# Altium project B905AA.PrjPcb (part 1 of 2)
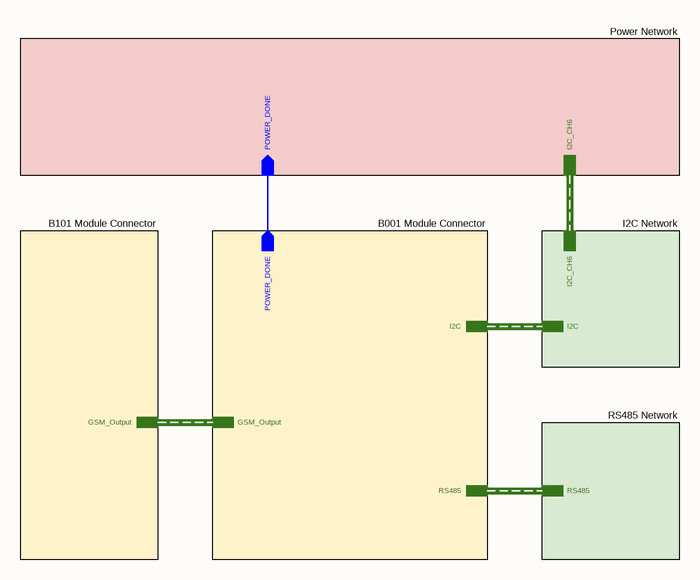
[diagram p0: Block Diagram.SchDoc]
Address1_: Buyuk Kayacik Mah. 4. OSB; Address2_: 103. Cad. No : 12; Address3_: Selcuklu / Konya; Address4_: Türkiye; Copyright_: Copyright 2022 STF Tarim (Commercial Secret); Customer_: STF Irrigation; Engineer_: Gunce Akkoyun; Git_Repo_Address_: www.github.com/akkoyun/B905AA; Module_ID_: B905AA; Organization_: STF Res-Dev; Product_Desc_: P101DA; Product_ID_: P101DA; Revision_: 00.00.01; Version_: R1
18 sheets, 99 parts. Net scope: hierarchical (ports join the sheet entries above them; power ports are global).
Board file: B905AA.PcbDoc
Sheets:
  Block Diagram.SchDoc
    B001 Module Connector = B001 PCIe Socket.SchDoc
    B101 Module Connector = B101 PCIe Socket.SchDoc
    I2C Network = I2C Network.SchDoc
      I2C Multiplexer = I2C Multiplexer.SchDoc
      I2C DP Sensor 1 = I2C DP Sensor 1.SchDoc
      I2C DP Sensor 2 = I2C DP Sensor 2.SchDoc
      I2C DP Sensor 3 = I2C DP Sensor 3.SchDoc
      TH Sensor Connector = I2C TH Sensor Socket.SchDoc
      UV Sensor Connector = I2C UV Sensor.SchDoc
      Pressure Sensor = I2C P Sensor.SchDoc
    RS485 Network = RS485 Network.SchDoc
      RS485 Multiplexer = RS485 Multiplexer.SchDoc
      RS485 Rain Sensor Socket = RS485 Rain Sensor Socket.SchDoc
      RS485 ST Sensor Socket = RS485 Soil Temperature Sensor Socket.SchDoc
      RS485 Under Leaf Sensor Socket = RS485 Under Leaf Sensor Socket.SchDoc
      RS485 Reserved Sensor Socket = RS485 Reserved Sensor Socket.SchDoc
    Power Network = B802 PCIe Socket.SchDoc

## Sheet Block Diagram.SchDoc: Block Diagram
size 292 x 193 mm; SheetNumber: 1; SheetTotal: 18

### Sub-sheets
B001 Module Connector = B001 PCIe Socket.SchDoc: I2C (harness I2C), GSM_Output (harness GSM_Output), RS485 (harness RS485), POWER_DONE (out)
B101 Module Connector = B101 PCIe Socket.SchDoc: GSM_Output (harness GSM_Output)
I2C Network = I2C Network.SchDoc: I2C (harness I2C), I2C_CH6 (harness I2C_CH6)
Power Network = B802 PCIe Socket.SchDoc: POWER_DONE (in), I2C_CH6 (harness I2C_CH6)
RS485 Network = RS485 Network.SchDoc: RS485 (harness RS485)

### Nets
POWER_DONE: sheet B001 Module Connector/POWER_DONE, sheet Power Network/POWER_DONE

### Buses and harness runs
harness sheet B001 Module Connector/GSM_Output = sheet B101 Module Connector/GSM_Output
harness sheet B001 Module Connector/I2C = sheet I2C Network/I2C
harness sheet B001 Module Connector/RS485 = sheet RS485 Network/RS485
harness sheet I2C Network/I2C_CH6 = sheet Power Network/I2C_CH6

### Notes on the sheet
- © 2021 All rights reserved.
  This document may not, in whole or in part, be copied, photocopied, reproduced, translated or converted to any electronic or machine readable from without prior written permission of Mehmet Günce Akkoyun.
  Engineer contact : akkoyun@me.com
- Property of
- Engineer :
- Date :
- Size :
- A4
- Time :
- Project :
- Page :
- /
- Customer :
- Product ID :
- Module ID :
- Version :
- File :
- Revision :

## Sheet B001 PCIe Socket.SchDoc: B001 PCIe Socket
size 292 x 193 mm; SheetNumber: 16; SheetTotal: 18
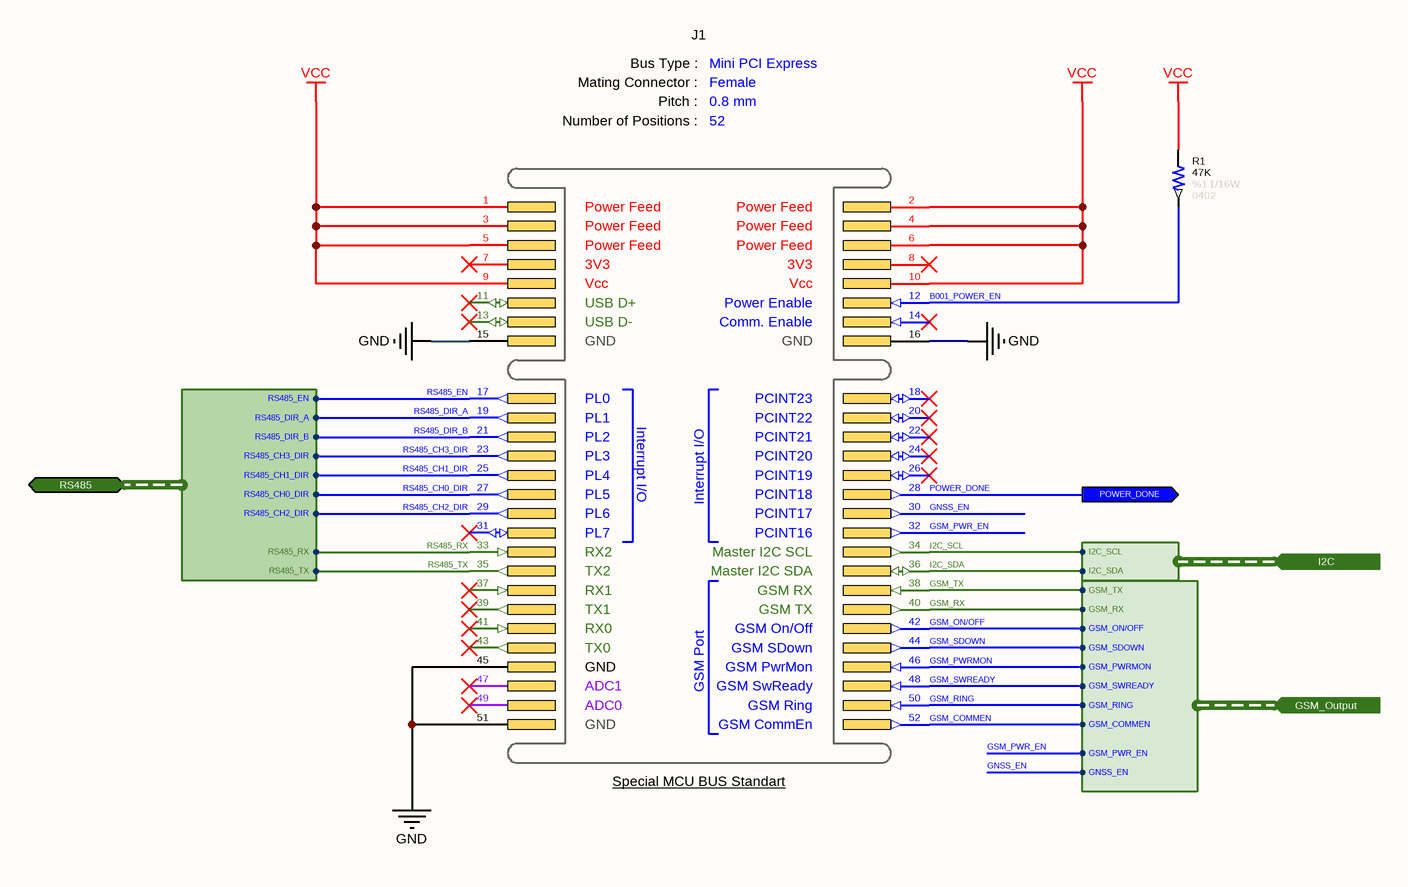
[diagram p1: B001 PCIe Socket.SchDoc]

### Parts
J1  BUS Type: Mini PCI Express  Connector Type: Female  Pitch: 0.8 mm  Number of Positions: 52  [CONNECTOR - Mini PCIe]  (hidden comment: TE-1775862-2)
R1  value 47K  Tolerance: %1  Case: 0402  Power: 1/16W  [RESISTOR_0402]  (hidden comment: 47K - 0402 - %1 - 1/16W)

### Ports
GSM_Output (in, harness GSM_Output), I2C (in, harness I2C), POWER_DONE (out), RS485 (bidir, harness RS485)

### Harnesses
I2C: I2C_SDA, I2C_SCL
RS485: RS485_RX, RS485_TX, RS485_EN, RS485_DIR_A, RS485_DIR_B, RS485_CH0_DIR, RS485_CH1_DIR, RS485_CH2_DIR, RS485_CH3_DIR
GSM_Output: GSM_SDOWN, GSM_ON/OFF, GSM_TX, GSM_RX, GSM_PWRMON, GSM_SWREADY, GSM_RING, GSM_COMMEN, GSM_PWR_EN, GNSS_EN

### Nets
GND: J1.15(Pin-15) J1.16(Pin-16) J1.45(Pin-45) J1.51(Pin-51)
VCC: J1.1(Pin-1) J1.2(Pin-2) J1.3(Pin-3) J1.4(Pin-4) J1.5(Pin-5) J1.6(Pin-6) J1.9(Pin-9) J1.10(Pin-10) R1.2
B001_POWER_EN: J1.12(Pin-12) R1.1
GNSS_EN: J1.30(Pin-30) ; port GSM_Output.GNSS_EN
GSM_COMMEN: J1.52(Pin-52) ; port GSM_Output.GSM_COMMEN
GSM_ON/OFF: J1.42(Pin-42) ; port GSM_Output.GSM_ON/OFF
GSM_PWR_EN: J1.32(Pin-32) ; port GSM_Output.GSM_PWR_EN
GSM_PWRMON: J1.46(Pin-46) ; port GSM_Output.GSM_PWRMON
GSM_RING: J1.50(Pin-50) ; port GSM_Output.GSM_RING
GSM_RX: J1.40(Pin-40) ; port GSM_Output.GSM_RX
GSM_SDOWN: J1.44(Pin-44) ; port GSM_Output.GSM_SDOWN
GSM_SWREADY: J1.48(Pin-48) ; port GSM_Output.GSM_SWREADY
GSM_TX: J1.38(Pin-38) ; port GSM_Output.GSM_TX
I2C_SCL: J1.34(Pin-34) ; port I2C.I2C_SCL
I2C_SDA: J1.36(Pin-36) ; port I2C.I2C_SDA
POWER_DONE: J1.28(Pin-28) ; port POWER_DONE
RS485_CH0_DIR: J1.27(Pin-27) ; port RS485.RS485_CH0_DIR
RS485_CH1_DIR: J1.25(Pin-25) ; port RS485.RS485_CH1_DIR
RS485_CH2_DIR: J1.29(Pin-29) ; port RS485.RS485_CH2_DIR
RS485_CH3_DIR: J1.23(Pin-23) ; port RS485.RS485_CH3_DIR
RS485_DIR_A: J1.19(Pin-19) ; port RS485.RS485_DIR_A
RS485_DIR_B: J1.21(Pin-21) ; port RS485.RS485_DIR_B
RS485_EN: J1.17(Pin-17) ; port RS485.RS485_EN
RS485_RX: J1.33(Pin-33) ; port RS485.RS485_RX
RS485_TX: J1.35(Pin-35) ; port RS485.RS485_TX

Not connected (* = marked no-connect by the designer): J1 7(Pin-7)* 8(Pin-8)* 11(Pin-11)* 13(Pin-13)* 14(Pin-14)* 18(Pin-18)* 20(Pin-20)* 22(Pin-22)* 24(Pin-24)* 26(Pin-26)* 31(Pin-31)* 37(Pin-37)* 39(Pin-39)* 41(Pin-41)* 43(Pin-43)* 47(Pin-47)* 49(Pin-49)*

### Notes on the sheet
- © 2021 All rights reserved.
  This document may not, in whole or in part, be copied, photocopied, reproduced, translated or converted to any electronic or machine readable from without prior written permission of Mehmet Günce Akkoyun.
  Engineer contact : akkoyun@me.com
- Property of
- Engineer :
- Date :
- Size :
- A4
- Time :
- Project :
- Page :
- /
- Customer :
- Product ID :
- Module ID :
- Version :
- File :
- Revision :
- (in symbol Connector - Mini PCI-E (Female B001)) Bus Type :; Mating Connector :; Pitch :; Number of Positions :; Power Feed; 3V3; Vcc; USB D+; Power Enable; USB D-; Comm. Enable; GND; PL0; PCINT23; PL1; PCINT22; Interrupt I/O; PL2; PCINT21; PL3; PCINT20; PL4; PCINT19; PL5; PCINT18; PL6; PCINT17; PL7; PCINT16; RX2; Master I2C SCL; TX2; Master I2C SDA; RX1; GSM RX; TX1; GSM TX; RX0; GSM Port; GSM On/Off; TX0; GSM SDown; GSM PwrMon; ADC1; GSM SwReady; ADC0; GSM Ring; GSM CommEn; Special MCU BUS Standart

### Library data of the parts
J1 = Connector - Mini PCI-E (Female B001): Mini PCI-Express female connector.; Manufacturer Name: TE Connectivity; Manufacturer Part Number: TE-1775862-2; System: Connector
R1 = Resistor - 47K [0402]: Thick Film Resistors - SMD 1/16 W 47 KOhm 1%; Manufacturer Name: Vishay; Manufacturer Part Number: CRCW040247K0FKED; ComponentLink1Description: DataSheet; ComponentLink1URL: https://www.mouser.com.tr/datasheet/2/427/dcrcwe3-1762152.pdf; ComponentLink2Description: Mouser; ComponentLink2URL: https://www.mouser.com.tr/ProductDetail/Vishay-Dale/CRCW040247K0FKED?qs=sGAEpiMZZMu61qfTUdNhG2DpbjADlD3GL%252B3h1elTxqU%3D

## Sheet B101 PCIe Socket.SchDoc: B101 PCIe Socket
size 292 x 193 mm; SheetNumber: 21; SheetTotal: 21
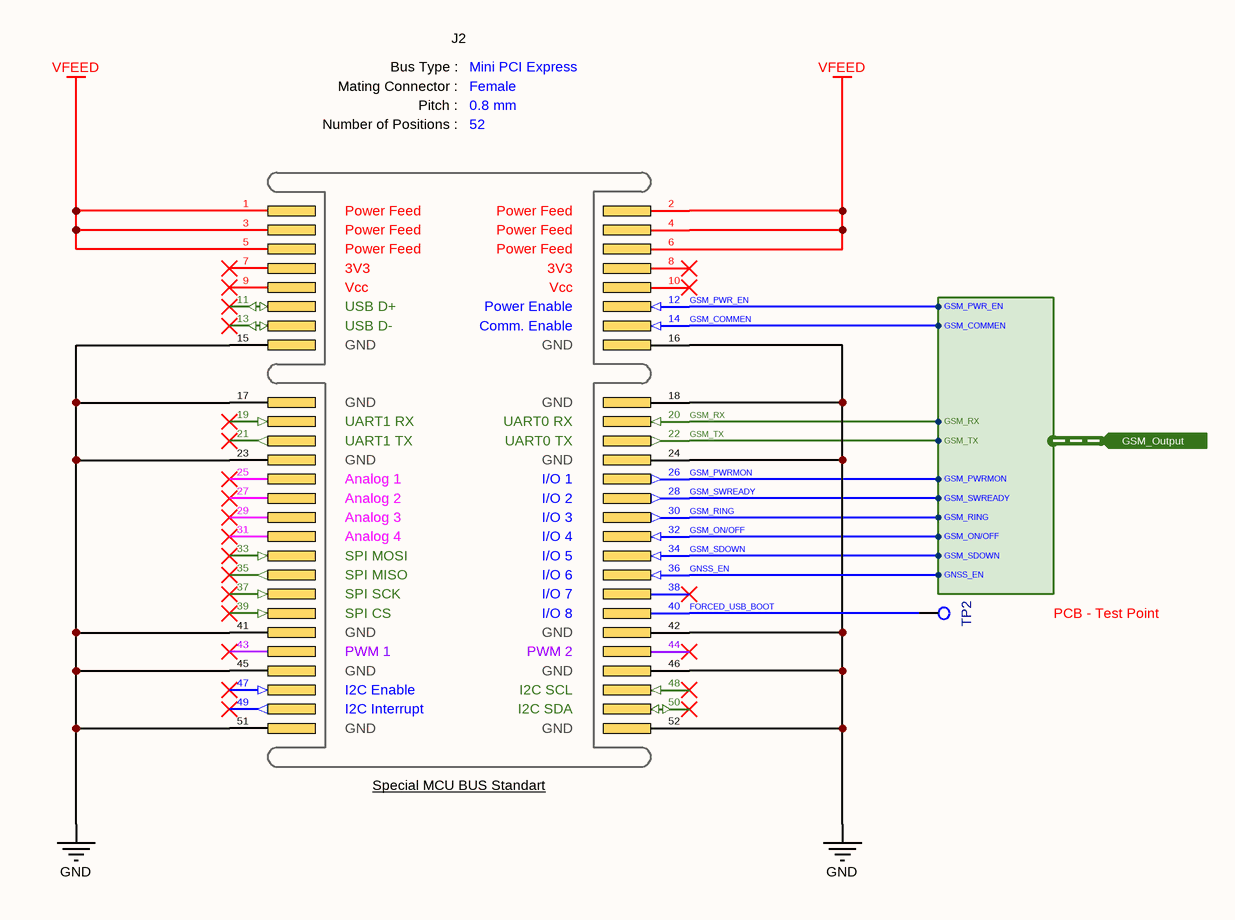
[diagram p2: B101 PCIe Socket.SchDoc]

### Parts
J2  BUS Type: Mini PCI Express  Connector Type: Female  Pitch: 0.8 mm  Number of Positions: 52  [CONNECTOR - Mini PCIe]  (hidden comment: TE-1775862-2)
TP2  PCB - Test Point  [Test_Point]  (no BOM)

### Ports
GSM_Output (in, harness GSM_Output)

### Harnesses
GSM_Output: GSM_SDOWN, GSM_ON/OFF, GSM_TX, GSM_RX, GSM_PWRMON, GSM_SWREADY, GSM_RING, GSM_COMMEN, GSM_PWR_EN, GNSS_EN

### Nets
GND: J2.15(Pin-15) J2.16(Pin-16) J2.17(Pin-17) J2.18(Pin-18) J2.23(Pin-23) J2.24(Pin-24) J2.41(Pin-41) J2.42(Pin-42) J2.45(Pin-45) J2.46(Pin-46) J2.51(Pin-51) J2.52(Pin-52)
VFEED: J2.1(Pin-1) J2.2(Pin-2) J2.3(Pin-3) J2.4(Pin-4) J2.5(Pin-5) J2.6(Pin-6)
FORCED_USB_BOOT: J2.40(Pin-40) TP2.1
GNSS_EN: J2.36(Pin-36) ; port GSM_Output.GNSS_EN
GSM_COMMEN: J2.14(Pin-14) ; port GSM_Output.GSM_COMMEN
GSM_ON/OFF: J2.32(Pin-32) ; port GSM_Output.GSM_ON/OFF
GSM_PWR_EN: J2.12(Pin-12) ; port GSM_Output.GSM_PWR_EN
GSM_PWRMON: J2.26(Pin-26) ; port GSM_Output.GSM_PWRMON
GSM_RING: J2.30(Pin-30) ; port GSM_Output.GSM_RING
GSM_RX: J2.20(Pin-20) ; port GSM_Output.GSM_RX
GSM_SDOWN: J2.34(Pin-34) ; port GSM_Output.GSM_SDOWN
GSM_SWREADY: J2.28(Pin-28) ; port GSM_Output.GSM_SWREADY
GSM_TX: J2.22(Pin-22) ; port GSM_Output.GSM_TX

Not connected (* = marked no-connect by the designer): J2 7(Pin-7)* 8(Pin-8)* 9(Pin-9)* 10(Pin-10)* 11(Pin-11)* 13(Pin-13)* 19(Pin-19)* 21(Pin-21)* 25(Pin-25)* 27(Pin-27)* 29(Pin-29)* 31(Pin-31)* 33(Pin-33)* 35(Pin-35)* 37(Pin-37)* 38(Pin-38)* 39(Pin-39)* 43(Pin-43)* 44(Pin-44)* 47(Pin-47)* 48(Pin-48)* 49(Pin-49)* 50(Pin-50)*

### Notes on the sheet
- © 2021 All rights reserved.
  This document may not, in whole or in part, be copied, photocopied, reproduced, translated or converted to any electronic or machine readable from without prior written permission of Mehmet Günce Akkoyun.
  Engineer contact : akkoyun@me.com
- Property of
- Engineer :
- Date :
- Size :
- A4
- Time :
- Project :
- Page :
- /
- Customer :
- Product ID :
- Module ID :
- Version :
- File :
- Revision :
- (in symbol Connector - Mini PCI-E (Female B101)) Bus Type :; Mating Connector :; Pitch :; Number of Positions :; Power Feed; 3V3; Vcc; USB D+; Power Enable; USB D-; Comm. Enable; GND; UART1 RX; UART0 RX; UART1 TX; UART0 TX; Analog 1; I/O 1; Analog 2; I/O 2; Analog 3; I/O 3; Analog 4; I/O 4; SPI MOSI; I/O 5; SPI MISO; I/O 6; SPI SCK; I/O 7; SPI CS; I/O 8; PWM 1; PWM 2; I2C Enable; I2C SCL; I2C Interrupt; I2C SDA; Special MCU BUS Standart

### Library data of the parts
J2 = Connector - Mini PCI-E (Female B101): Mini PCI-Express female connector.; Manufacturer Name: TE Connectivity; Manufacturer Part Number: TE-1775862-2; System: Connector
TP2 = PCB - Test Point: Test Point; Name: Name

## Sheet I2C Network.SchDoc: I2C Network
size 292 x 193 mm; SheetNumber: 6; SheetTotal: 22
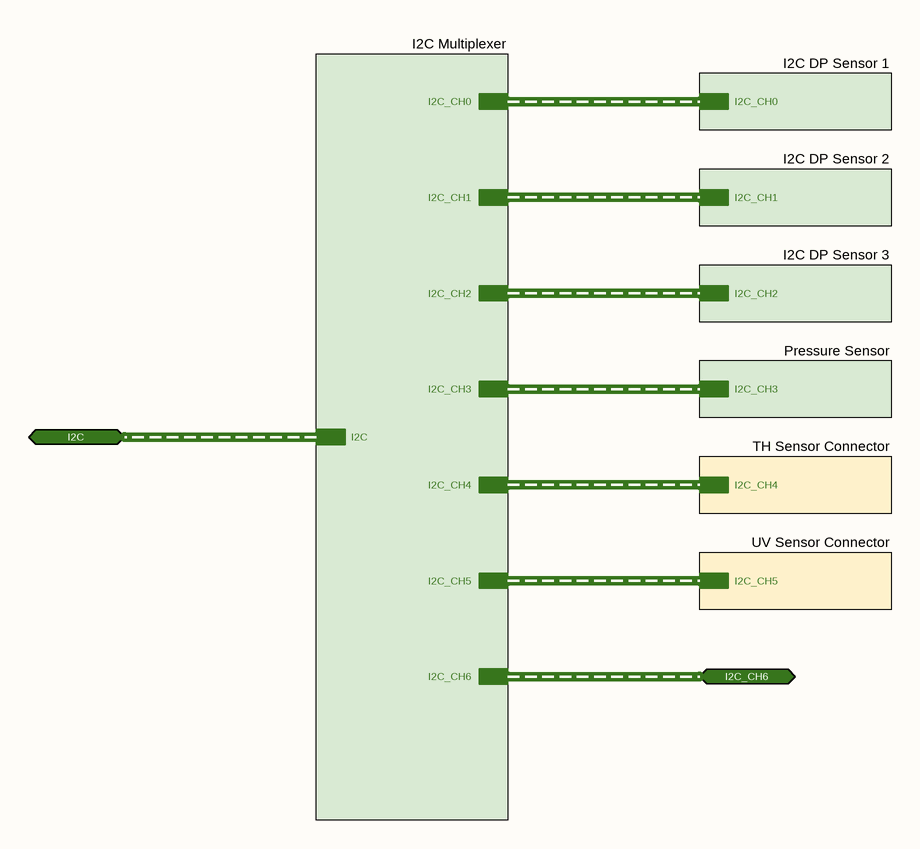
[diagram p3: I2C Network.SchDoc]

### Sub-sheets
I2C DP Sensor 1 = I2C DP Sensor 1.SchDoc: I2C_CH0 (harness I2C_CH0)
I2C DP Sensor 2 = I2C DP Sensor 2.SchDoc: I2C_CH1 (harness I2C_CH1)
I2C DP Sensor 3 = I2C DP Sensor 3.SchDoc: I2C_CH2 (harness I2C_CH2)
I2C Multiplexer = I2C Multiplexer.SchDoc: I2C_CH3 (harness I2C_CH3), I2C_CH6 (harness I2C_CH6), I2C_CH5 (harness I2C_CH5), I2C (harness I2C), I2C_CH1 (harness I2C_CH1), I2C_CH2 (harness I2C_CH2), I2C_CH0 (harness I2C_CH0), I2C_CH4 (harness I2C_CH4)
Pressure Sensor = I2C P Sensor.SchDoc: I2C_CH3 (harness I2C_CH3)
TH Sensor Connector = I2C TH Sensor Socket.SchDoc: I2C_CH4 (harness I2C_CH4)
UV Sensor Connector = I2C UV Sensor.SchDoc: I2C_CH5 (harness I2C_CH5)

### Ports
I2C (bidir, harness I2C), I2C_CH6 (bidir, harness I2C_CH6)

### Buses and harness runs
harness port I2C = sheet I2C Multiplexer/I2C
harness port I2C_CH6 = sheet I2C Multiplexer/I2C_CH6
harness sheet I2C DP Sensor 1/I2C_CH0 = sheet I2C Multiplexer/I2C_CH0
harness sheet I2C DP Sensor 2/I2C_CH1 = sheet I2C Multiplexer/I2C_CH1
harness sheet I2C DP Sensor 3/I2C_CH2 = sheet I2C Multiplexer/I2C_CH2
harness sheet I2C Multiplexer/I2C_CH3 = sheet Pressure Sensor/I2C_CH3
harness sheet I2C Multiplexer/I2C_CH4 = sheet TH Sensor Connector/I2C_CH4
harness sheet I2C Multiplexer/I2C_CH5 = sheet UV Sensor Connector/I2C_CH5

### Notes on the sheet
- © 2021 All rights reserved.
  This document may not, in whole or in part, be copied, photocopied, reproduced, translated or converted to any electronic or machine readable from without prior written permission of Mehmet Günce Akkoyun.
  Engineer contact : akkoyun@me.com
- Property of
- Engineer :
- Date :
- Size :
- A4
- Time :
- Project :
- Page :
- /
- Customer :
- Product ID :
- Module ID :
- Version :
- File :
- Revision :

## Sheet I2C Multiplexer.SchDoc: I2C Multiplexer
size 292 x 193 mm; SheetNumber: 7; SheetTotal: 22
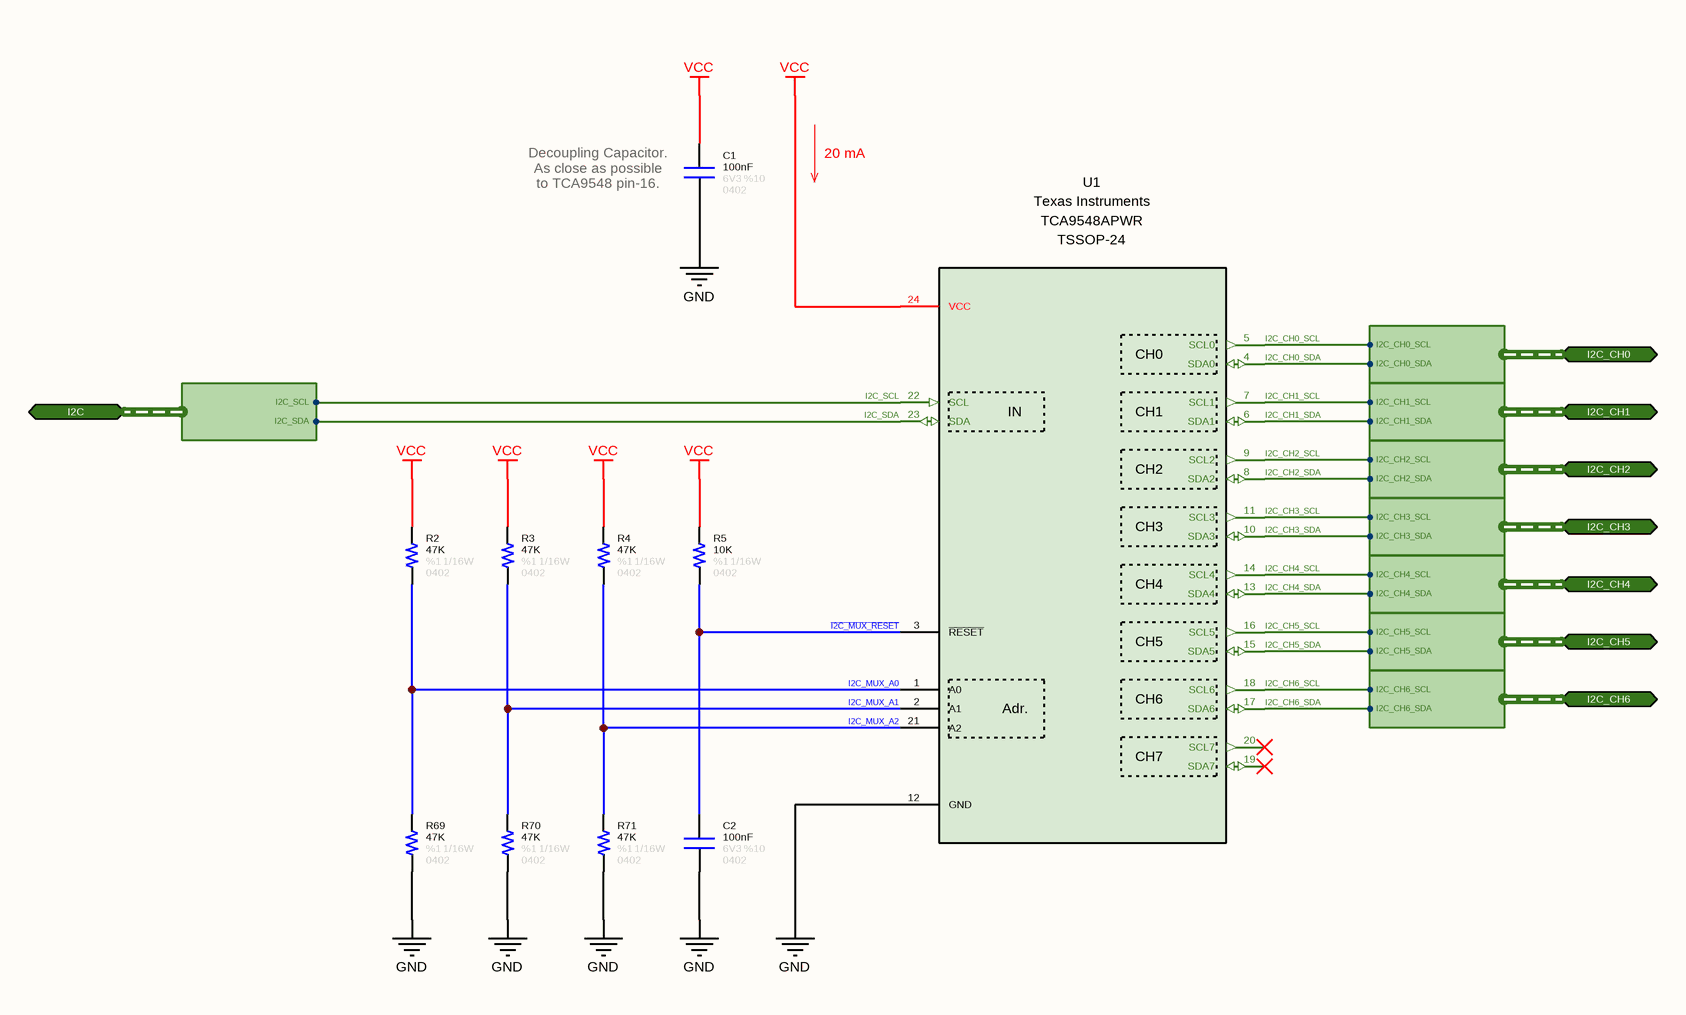
[diagram p4: I2C Multiplexer.SchDoc]

### Parts
C1  value 100nF  Tolerance: %10  Voltage: 6V3  Case: 0402  [CAPACITOR_0402]  (hidden comment: Capacitor - 100nF [0402] (Ceramic))
C2  value 100nF  Tolerance: %10  Voltage: 6V3  Case: 0402  [CAPACITOR_0402]  (hidden comment: Capacitor - 100nF [0402] (Ceramic))
R2  value 47K  Tolerance: %1  Case: 0402  Power: 1/16W  [RESISTOR_0402]  (hidden comment: 47K - 0402 - %1 - 1/16W)
R3  value 47K  Tolerance: %1  Case: 0402  Power: 1/16W  [RESISTOR_0402]  (hidden comment: 47K - 0402 - %1 - 1/16W)
R4  value 47K  Tolerance: %1  Case: 0402  Power: 1/16W  [RESISTOR_0402]  (hidden comment: 47K - 0402 - %1 - 1/16W)
R5  value 10K  Tolerance: %1  Case: 0402  Power: 1/16W  [RESISTOR_0402]  (hidden comment: 10K - 0402 - %1 - 1/16W)
R69  value 47K  Tolerance: %1  Case: 0402  Power: 1/16W  [RESISTOR_0402]  (hidden comment: 47K - 0402 - %1 - 1/16W)
R70  value 47K  Tolerance: %1  Case: 0402  Power: 1/16W  [RESISTOR_0402]  (hidden comment: 47K - 0402 - %1 - 1/16W)
R71  value 47K  Tolerance: %1  Case: 0402  Power: 1/16W  [RESISTOR_0402]  (hidden comment: 47K - 0402 - %1 - 1/16W)
U1  Manufacturer Name: Texas Instruments  [TSSOP-24]  (hidden comment: TCA9548APWR)

### Ports
I2C (bidir, harness I2C), I2C_CH0 (bidir, harness I2C_CH0), I2C_CH1 (bidir, harness I2C_CH1), I2C_CH2 (bidir, harness I2C_CH2), I2C_CH3 (bidir, harness I2C_CH3), I2C_CH4 (bidir, harness I2C_CH4), I2C_CH5 (bidir, harness I2C_CH5), I2C_CH6 (bidir, harness I2C_CH6)

### Harnesses
I2C_CH0: I2C_CH0_SCL, I2C_CH0_SDA
I2C_CH1: I2C_CH1_SCL, I2C_CH1_SDA
I2C_CH2: I2C_CH2_SCL, I2C_CH2_SDA
I2C_CH3: I2C_CH3_SCL, I2C_CH3_SDA
I2C_CH4: I2C_CH4_SCL, I2C_CH4_SDA
I2C_CH5: I2C_CH5_SCL, I2C_CH5_SDA
I2C_CH6: I2C_CH6_SCL, I2C_CH6_SDA
I2C: I2C_SDA, I2C_SCL

### Nets
GND: C1.1 C2.1 R69.1 R70.1 R71.1 U1.12(GND)
VCC: C1.2 R2.2 R3.2 R4.2 R5.2 U1.24(VCC)
I2C_CH0_SCL: U1.5(SCL0) ; port I2C_CH0.I2C_CH0_SCL
I2C_CH0_SDA: U1.4(SDA0) ; port I2C_CH0.I2C_CH0_SDA
I2C_CH1_SCL: U1.7(SCL1) ; port I2C_CH1.I2C_CH1_SCL
I2C_CH1_SDA: U1.6(SDA1) ; port I2C_CH1.I2C_CH1_SDA
I2C_CH2_SCL: U1.9(SCL2) ; port I2C_CH2.I2C_CH2_SCL
I2C_CH2_SDA: U1.8(SDA2) ; port I2C_CH2.I2C_CH2_SDA
I2C_CH3_SCL: U1.11(SCL3) ; port I2C_CH3.I2C_CH3_SCL
I2C_CH3_SDA: U1.10(SDA3) ; port I2C_CH3.I2C_CH3_SDA
I2C_CH4_SCL: U1.14(SCL4) ; port I2C_CH4.I2C_CH4_SCL
I2C_CH4_SDA: U1.13(SDA4) ; port I2C_CH4.I2C_CH4_SDA
I2C_CH5_SCL: U1.16(SCL5) ; port I2C_CH5.I2C_CH5_SCL
I2C_CH5_SDA: U1.15(SDA5) ; port I2C_CH5.I2C_CH5_SDA
I2C_CH6_SCL: U1.18(SCL6) ; port I2C_CH6.I2C_CH6_SCL
I2C_CH6_SDA: U1.17(SDA6) ; port I2C_CH6.I2C_CH6_SDA
I2C_MUX_A0: R2.1 R69.2 U1.1(A0)
I2C_MUX_A1: R3.1 R70.2 U1.2(A1)
I2C_MUX_A2: R4.1 R71.2 U1.21(A2)
I2C_SCL: U1.22(SCL) ; port I2C.I2C_SCL
I2C_SDA: U1.23(SDA) ; port I2C.I2C_SDA
~{I2C_MUX_RESET}: C2.2 R5.1 U1.3(~{RESET})

Not connected (* = marked no-connect by the designer): U1 19(SDA7)* 20(SCL7)*

### Notes on the sheet
- (near C1) Decoupling Capacitor. As close as possible to TCA9548 pin-16.
- 20 mA
- © 2021 All rights reserved.
  This document may not, in whole or in part, be copied, photocopied, reproduced, translated or converted to any electronic or machine readable from without prior written permission of Mehmet Günce Akkoyun.
  Engineer contact : akkoyun@me.com
- Property of
- Engineer :
- Date :
- Size :
- A4
- Time :
- Project :
- Page :
- /
- Customer :
- Product ID :
- Module ID :
- Version :
- File :
- Revision :
- (in symbol IC - TCA9548) CH0; IN; CH1; CH2; CH3; CH4; CH5; CH6; Adr.; CH7

### Library data of the parts
C1 C2 = Capacitor - 100nF [0402-6V3]: Capacitor - 100nF [0402-6V3] (Ceramic); Manufacturer Name: AVX; Manufacturer Part Number: 04026D104KAT4A; ComponentLink1Description: Mouser; ComponentLink1URL: https://www.mouser.com.tr/ProductDetail/AVX/04026D104KAT4A?qs=sGAEpiMZZMs0AnBnWHyRQPg4iYkCw7IMED%2F4kpqgf7w%3D; ComponentLink2Description: DataSheet; ComponentLink2URL: https://www.mouser.com.tr/datasheet/2/40/cx5r-776519.pdf
R2-R4 R69-R71 = Resistor - 47K [0402]: as R1 on sheet B001 PCIe Socket; ComponentLink1Description: DataSheet; ComponentLink1URL: https://www.mouser.com.tr/datasheet/2/427/dcrcwe3-1762152.pdf; ComponentLink2Description: Mouser; ComponentLink2URL: https://www.mouser.com.tr/ProductDetail/Vishay-Dale/CRCW040247K0FKED?qs=sGAEpiMZZMu61qfTUdNhG2DpbjADlD3GL%252B3h1elTxqU%3D
R5 = Resistor - 10K [0402]: Thick Film Resistors - SMD 1/16 W 10 KOhm 1%; Manufacturer Name: Vishay; Manufacturer Part Number: CRCW040210K0FKED; ComponentLink1Description: DataSheet; ComponentLink1URL: https://www.mouser.com.tr/datasheet/2/427/dcrcwe3-1762152.pdf; ComponentLink2Description: Mouser; ComponentLink2URL: https://www.mouser.com.tr/ProductDetail/Vishay-Dale/CRCW040210K0FKED?qs=sGAEpiMZZMu61qfTUdNhG2DpbjADlD3GcalbOv9utCY%3D
U1 = IC - TCA9548: TEXAS INSTRUMENTS - TCA9548APWR - I2C SWITCH W/ RESET, 8-CH, TSSOP-24; Supply Current - Max: 80 uA; Channel: 8; Maximum Operating Temperature: + 85 C; Minimum Operating Temperature: - 40 C; Product Type: Switch ICs; Manufacturer Part Number: TCA9548APWR; Case: TSSOP-24

## Sheet I2C DP Sensor 1.SchDoc: I2C Delta Pressure Sensor 1
size 292 x 193 mm; SheetNumber: 8; SheetTotal: 21
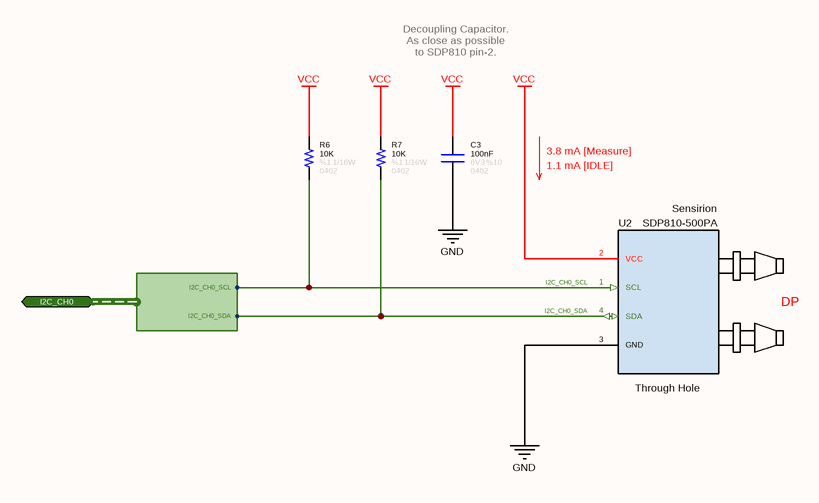
[diagram p5: I2C DP Sensor 1.SchDoc]

### Parts
C3  value 100nF  Tolerance: %10  Voltage: 6V3  Case: 0402  [CAPACITOR_0402]  (hidden comment: Capacitor - 100nF [0402] (Ceramic))
R6  value 10K  Tolerance: %1  Case: 0402  Power: 1/16W  [RESISTOR_0402]  (hidden comment: 10K - 0402 - %1 - 1/16W)
R7  value 10K  Tolerance: %1  Case: 0402  Power: 1/16W  [RESISTOR_0402]  (hidden comment: 10K - 0402 - %1 - 1/16W)
U2  Manufacturer Name: Sensirion  Case: Through Hole  [SDP810-500PA]  (hidden comment: SDP810-500PA)

### Ports
I2C_CH0 (bidir, harness I2C_CH0)

### Harnesses
I2C_CH0: I2C_CH0_SCL, I2C_CH0_SDA

### Nets
GND: C3.1 U2.3(GND)
VCC: C3.2 R6.2 R7.2 U2.2(VCC)
I2C_CH0_SCL: R6.1 U2.1(SCL) ; port I2C_CH0.I2C_CH0_SCL
I2C_CH0_SDA: R7.1 U2.4(SDA) ; port I2C_CH0.I2C_CH0_SDA

### Notes on the sheet
- Decoupling Capacitor. As close as possible to SDP810 pin-2.
- 3.8 mA [Measure]
- 1.1 mA [IDLE]
- © 2021 All rights reserved.
  This document may not, in whole or in part, be copied, photocopied, reproduced, translated or converted to any electronic or machine readable from without prior written permission of Mehmet Günce Akkoyun.
  Engineer contact : akkoyun@me.com
- Property of
- Engineer :
- Date :
- Size :
- A4
- Time :
- Project :
- Page :
- /
- Customer :
- Product ID :
- Module ID :
- Version :
- File :
- Revision :
- (in symbol IC - SDP810-500PA) DP

### Library data of the parts
C3 = Capacitor - 100nF [0402-6V3]: as C1 on sheet I2C Multiplexer; ComponentLink1Description: Mouser; ComponentLink1URL: https://www.mouser.com.tr/ProductDetail/AVX/04026D104KAT4A?qs=sGAEpiMZZMs0AnBnWHyRQPg4iYkCw7IMED%2F4kpqgf7w%3D; ComponentLink2Description: DataSheet; ComponentLink2URL: https://www.mouser.com.tr/datasheet/2/40/cx5r-776519.pdf
R6 R7 = Resistor - 10K [0402]: as R5 on sheet I2C Multiplexer; ComponentLink1Description: DataSheet; ComponentLink1URL: https://www.mouser.com.tr/datasheet/2/427/dcrcwe3-1762152.pdf; ComponentLink2Description: Mouser; ComponentLink2URL: https://www.mouser.com.tr/ProductDetail/Vishay-Dale/CRCW040210K0FKED?qs=sGAEpiMZZMu61qfTUdNhG2DpbjADlD3GcalbOv9utCY%3D
U2 = IC - SDP810-500PA: Board Mount Pressure Sensors Tube Connection, I2C , 500Pa; Operating Pressure: - 500 Pa to 500 Pa; Accuracy: 3 %; RoHS: Yes; Product Type: Differential Pressure Sensors; Manufacturer Part Number: SDP810-500PA

## Sheet I2C DP Sensor 2.SchDoc: I2C Delta Pressure Sensor 2
size 292 x 193 mm; SheetNumber: 9; SheetTotal: 21
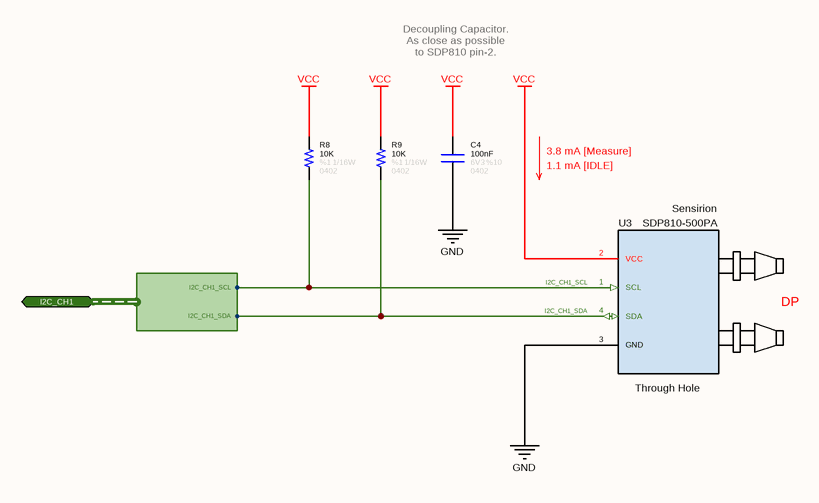
[diagram p6: I2C DP Sensor 2.SchDoc]

### Parts
C4  value 100nF  Tolerance: %10  Voltage: 6V3  Case: 0402  [CAPACITOR_0402]  (hidden comment: Capacitor - 100nF [0402] (Ceramic))
R8  value 10K  Tolerance: %1  Case: 0402  Power: 1/16W  [RESISTOR_0402]  (hidden comment: 10K - 0402 - %1 - 1/16W)
R9  value 10K  Tolerance: %1  Case: 0402  Power: 1/16W  [RESISTOR_0402]  (hidden comment: 10K - 0402 - %1 - 1/16W)
U3  Manufacturer Name: Sensirion  Case: Through Hole  [SDP810-500PA]  (hidden comment: SDP810-500PA)

### Ports
I2C_CH1 (bidir, harness I2C_CH1)

### Harnesses
I2C_CH1: I2C_CH1_SCL, I2C_CH1_SDA

### Nets
GND: C4.1 U3.3(GND)
VCC: C4.2 R8.2 R9.2 U3.2(VCC)
I2C_CH1_SCL: R8.1 U3.1(SCL) ; port I2C_CH1.I2C_CH1_SCL
I2C_CH1_SDA: R9.1 U3.4(SDA) ; port I2C_CH1.I2C_CH1_SDA

### Notes on the sheet
- Decoupling Capacitor. As close as possible to SDP810 pin-2.
- 3.8 mA [Measure]
- 1.1 mA [IDLE]
- © 2021 All rights reserved.
  This document may not, in whole or in part, be copied, photocopied, reproduced, translated or converted to any electronic or machine readable from without prior written permission of Mehmet Günce Akkoyun.
  Engineer contact : akkoyun@me.com
- Property of
- Engineer :
- Date :
- Size :
- A4
- Time :
- Project :
- Page :
- /
- Customer :
- Product ID :
- Module ID :
- Version :
- File :
- Revision :
- (in symbol IC - SDP810-500PA) DP

### Library data of the parts
C4 = Capacitor - 100nF [0402-6V3]: as C1 on sheet I2C Multiplexer; ComponentLink1Description: Mouser; ComponentLink1URL: https://www.mouser.com.tr/ProductDetail/AVX/04026D104KAT4A?qs=sGAEpiMZZMs0AnBnWHyRQPg4iYkCw7IMED%2F4kpqgf7w%3D; ComponentLink2Description: DataSheet; ComponentLink2URL: https://www.mouser.com.tr/datasheet/2/40/cx5r-776519.pdf
R8 R9 = Resistor - 10K [0402]: as R5 on sheet I2C Multiplexer; ComponentLink1Description: DataSheet; ComponentLink1URL: https://www.mouser.com.tr/datasheet/2/427/dcrcwe3-1762152.pdf; ComponentLink2Description: Mouser; ComponentLink2URL: https://www.mouser.com.tr/ProductDetail/Vishay-Dale/CRCW040210K0FKED?qs=sGAEpiMZZMu61qfTUdNhG2DpbjADlD3GcalbOv9utCY%3D
U3 = IC - SDP810-500PA: as U2 on sheet I2C DP Sensor 1; RoHS: Yes; Product Type: Differential Pressure Sensors; Manufacturer Part Number: SDP810-500PA

## Sheet I2C DP Sensor 3.SchDoc: I2C Delta Pressure Sensor 3
size 292 x 193 mm; SheetNumber: 10; SheetTotal: 21
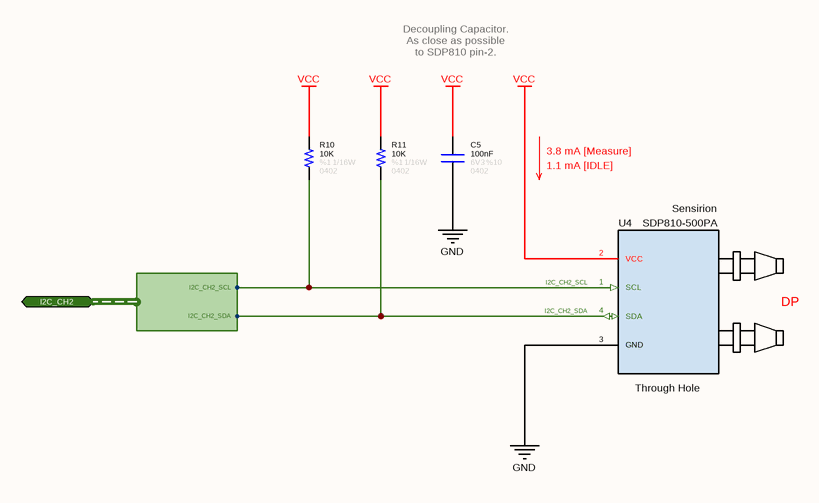
[diagram p7: I2C DP Sensor 3.SchDoc]

### Parts
C5  value 100nF  Tolerance: %10  Voltage: 6V3  Case: 0402  [CAPACITOR_0402]  (hidden comment: Capacitor - 100nF [0402] (Ceramic))
R10  value 10K  Tolerance: %1  Case: 0402  Power: 1/16W  [RESISTOR_0402]  (hidden comment: 10K - 0402 - %1 - 1/16W)
R11  value 10K  Tolerance: %1  Case: 0402  Power: 1/16W  [RESISTOR_0402]  (hidden comment: 10K - 0402 - %1 - 1/16W)
U4  Manufacturer Name: Sensirion  Case: Through Hole  [SDP810-500PA]  (hidden comment: SDP810-500PA)

### Ports
I2C_CH2 (bidir, harness I2C_CH2)

### Harnesses
I2C_CH2: I2C_CH2_SCL, I2C_CH2_SDA

### Nets
GND: C5.1 U4.3(GND)
VCC: C5.2 R10.2 R11.2 U4.2(VCC)
I2C_CH2_SCL: R10.1 U4.1(SCL) ; port I2C_CH2.I2C_CH2_SCL
I2C_CH2_SDA: R11.1 U4.4(SDA) ; port I2C_CH2.I2C_CH2_SDA

### Notes on the sheet
- Decoupling Capacitor. As close as possible to SDP810 pin-2.
- 3.8 mA [Measure]
- 1.1 mA [IDLE]
- © 2021 All rights reserved.
  This document may not, in whole or in part, be copied, photocopied, reproduced, translated or converted to any electronic or machine readable from without prior written permission of Mehmet Günce Akkoyun.
  Engineer contact : akkoyun@me.com
- Property of
- Engineer :
- Date :
- Size :
- A4
- Time :
- Project :
- Page :
- /
- Customer :
- Product ID :
- Module ID :
- Version :
- File :
- Revision :
- (in symbol IC - SDP810-500PA) DP

### Library data of the parts
C5 = Capacitor - 100nF [0402-6V3]: as C1 on sheet I2C Multiplexer; ComponentLink1Description: Mouser; ComponentLink1URL: https://www.mouser.com.tr/ProductDetail/AVX/04026D104KAT4A?qs=sGAEpiMZZMs0AnBnWHyRQPg4iYkCw7IMED%2F4kpqgf7w%3D; ComponentLink2Description: DataSheet; ComponentLink2URL: https://www.mouser.com.tr/datasheet/2/40/cx5r-776519.pdf
R10 R11 = Resistor - 10K [0402]: as R5 on sheet I2C Multiplexer; ComponentLink1Description: DataSheet; ComponentLink1URL: https://www.mouser.com.tr/datasheet/2/427/dcrcwe3-1762152.pdf; ComponentLink2Description: Mouser; ComponentLink2URL: https://www.mouser.com.tr/ProductDetail/Vishay-Dale/CRCW040210K0FKED?qs=sGAEpiMZZMu61qfTUdNhG2DpbjADlD3GcalbOv9utCY%3D
U4 = IC - SDP810-500PA: as U2 on sheet I2C DP Sensor 1; RoHS: Yes; Product Type: Differential Pressure Sensors; Manufacturer Part Number: SDP810-500PA

## Sheet I2C TH Sensor Socket.SchDoc: I2C TH Sensor Socket
size 292 x 193 mm; SheetNumber: 12; SheetTotal: 21
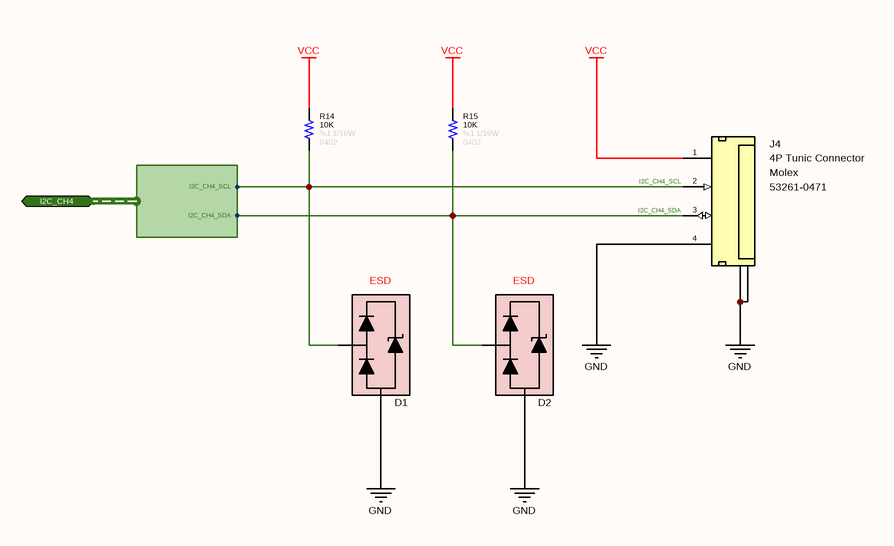
[diagram p8: I2C TH Sensor Socket.SchDoc]

### Parts
D1  0402ESDA-MLP1  [ESD_0402]  (value not drawn)
D2  0402ESDA-MLP1  [ESD_0402]  (value not drawn)
J4  Manufacturer Name: Molex  Manufacturer Part Number: 53261-0471  [Connector_Tunic 4P]  (hidden comment: 4P SMD Tunic Connector)
R14  value 10K  Tolerance: %1  Case: 0402  Power: 1/16W  [RESISTOR_0402]  (hidden comment: 10K - 0402 - %1 - 1/16W)
R15  value 10K  Tolerance: %1  Case: 0402  Power: 1/16W  [RESISTOR_0402]  (hidden comment: 10K - 0402 - %1 - 1/16W)

### Ports
I2C_CH4 (bidir, harness I2C_CH4)

### Harnesses
I2C_CH4: I2C_CH4_SCL, I2C_CH4_SDA

### Nets
GND: D1.2(GND) D2.2(GND) J4.4(Pin-4) J4.5(GND) J4.6(GND)
VCC: J4.1(Pin-1) R14.2 R15.2
I2C_CH4_SCL: D1.1(I/O) J4.2(Pin-2) R14.1 ; port I2C_CH4.I2C_CH4_SCL
I2C_CH4_SDA: D2.1(I/O) J4.3(Pin-3) R15.1 ; port I2C_CH4.I2C_CH4_SDA

### Notes on the sheet
- © 2021 All rights reserved.
  This document may not, in whole or in part, be copied, photocopied, reproduced, translated or converted to any electronic or machine readable from without prior written permission of Mehmet Günce Akkoyun.
  Engineer contact : akkoyun@me.com
- Property of
- Engineer :
- Date :
- Size :
- A4
- Time :
- Project :
- Page :
- /
- Customer :
- Product ID :
- Module ID :
- Version :
- File :
- Revision :
- (in symbol Connector - Mini Tunic 4P (1.25)) 4P Tunic Connector
- (in symbol Diode - TPD1E05U06DPYR) ESD

### Library data of the parts
D1 D2 = Diode - TPD1E05U06DPYR: SUPPRESSOR ESD 30VDC 0402 HFREE; Manufacturer Name: Eaton; Breakdown Voltage: 30V; Capacitance: 0.15pF; Manufacturer Part Number: 0402ESDA-MLP1; Case: 0402
J4 = Connector - Mini Tunic 4P (1.25): Mini Tunic Connector with 4P; Pitch: 1.25mm; Position: 4; ROHS: Yes; ComponentLink1Description: DataSheet; ComponentLink1URL: https://www.mouser.com.tr/datasheet/2/276/0532610471_PCB_HEADERS-170942.pdf; ComponentLink2Description: Mouser; ComponentLink2URL: https://www.mouser.com.tr/ProductDetail/Molex/53261-0471?qs=%2Fha2pyFaduhLhIsk8tywtK7BwWtguBSP4XxyDBTOTfs%3D; Case: SMD
R14 R15 = Resistor - 10K [0402]: as R5 on sheet I2C Multiplexer; ComponentLink1Description: DataSheet; ComponentLink1URL: https://www.mouser.com.tr/datasheet/2/427/dcrcwe3-1762152.pdf; ComponentLink2Description: Mouser; ComponentLink2URL: https://www.mouser.com.tr/ProductDetail/Vishay-Dale/CRCW040210K0FKED?qs=sGAEpiMZZMu61qfTUdNhG2DpbjADlD3GcalbOv9utCY%3D

## Sheet I2C UV Sensor.SchDoc: I2C UV Sensor Socket
size 292 x 193 mm; SheetNumber: 21; SheetTotal: 21
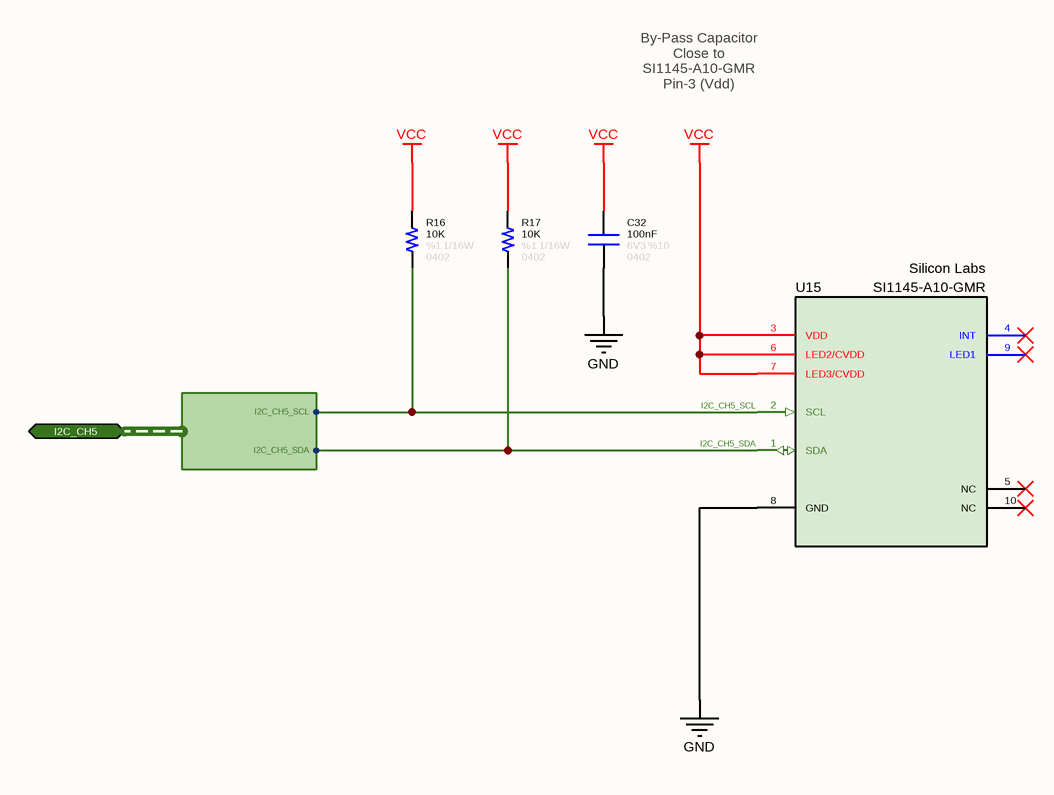
[diagram p9: I2C UV Sensor.SchDoc]

### Parts
C32  value 100nF  Tolerance: %10  Voltage: 6V3  Case: 0402  [CAPACITOR_0402]  (hidden comment: Capacitor - 100nF [0402] (Ceramic))
R16  value 10K  Tolerance: %1  Case: 0402  Power: 1/16W  [RESISTOR_0402]  (hidden comment: 10K - 0402 - %1 - 1/16W)
R17  value 10K  Tolerance: %1  Case: 0402  Power: 1/16W  [RESISTOR_0402]  (hidden comment: 10K - 0402 - %1 - 1/16W)
U15  Manufacturer Name: Silicon Labs  [SI1145]  (hidden comment: Si1145-A10-GMR)

### Ports
I2C_CH5 (bidir, harness I2C_CH5)

### Harnesses
I2C_CH5: I2C_CH5_SCL, I2C_CH5_SDA

### Nets
GND: C32.1 U15.8(GND)
VCC: C32.2 R16.2 R17.2 U15.3(VDD) U15.6(LED2/CVDD) U15.7(LED3/CVDD)
I2C_CH5_SCL: R16.1 U15.2(SCL) ; port I2C_CH5.I2C_CH5_SCL
I2C_CH5_SDA: R17.1 U15.1(SDA) ; port I2C_CH5.I2C_CH5_SDA

Not connected (* = marked no-connect by the designer): U15 4(INT)* 5(NC)* 9(LED1)* 10(NC)*

### Notes on the sheet
- By-Pass Capacitor
  Close to SI1145-A10-GMR
  Pin-3 (Vdd)
- © 2021 All rights reserved.
  This document may not, in whole or in part, be copied, photocopied, reproduced, translated or converted to any electronic or machine readable from without prior written permission of Mehmet Günce Akkoyun.
  Engineer contact : akkoyun@me.com
- Property of
- Engineer :
- Date :
- Size :
- A4
- Time :
- Project :
- Page :
- /
- Customer :
- Product ID :
- Module ID :
- Version :
- File :
- Revision :

### Library data of the parts
C32 = Capacitor - 100nF [0402-6V3]: as C1 on sheet I2C Multiplexer; ComponentLink1Description: Mouser; ComponentLink1URL: https://www.mouser.com.tr/ProductDetail/AVX/04026D104KAT4A?qs=sGAEpiMZZMs0AnBnWHyRQPg4iYkCw7IMED%2F4kpqgf7w%3D; ComponentLink2Description: DataSheet; ComponentLink2URL: https://www.mouser.com.tr/datasheet/2/40/cx5r-776519.pdf
R16 R17 = Resistor - 10K [0402]: as R5 on sheet I2C Multiplexer; ComponentLink1Description: DataSheet; ComponentLink1URL: https://www.mouser.com.tr/datasheet/2/427/dcrcwe3-1762152.pdf; ComponentLink2Description: Mouser; ComponentLink2URL: https://www.mouser.com.tr/ProductDetail/Vishay-Dale/CRCW040210K0FKED?qs=sGAEpiMZZMu61qfTUdNhG2DpbjADlD3GcalbOv9utCY%3D
U15 = IC - Si1145-A10-GMR: Proximity Sensors I2C UV Index and Proximity/Ambient Light Sensor with 1 LED Driver; Case: QFN-10; RoHS: Yes; Manufacturer Part Number: SI1145-A10-GMR

## Sheet I2C P Sensor.SchDoc: Air Pressure Sensor
size 292 x 193 mm; SheetNumber: 11; SheetTotal: 21
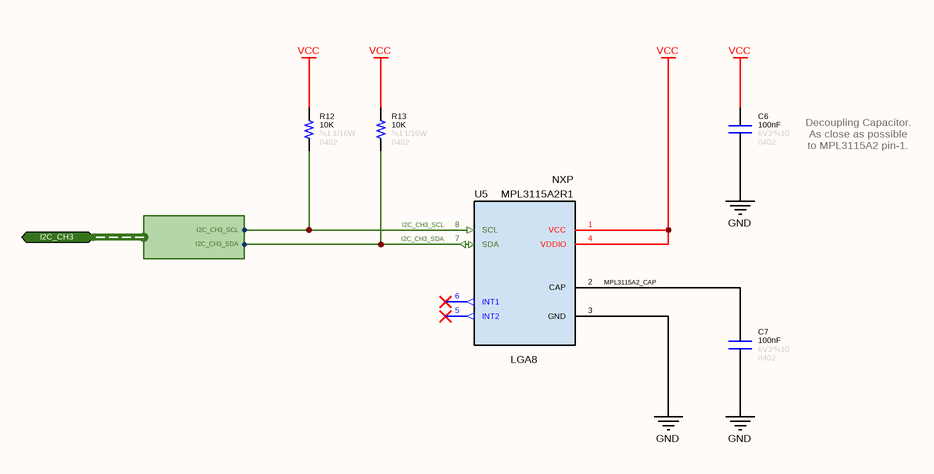
[diagram p10: I2C P Sensor.SchDoc]

### Parts
C6  value 100nF  Tolerance: %10  Voltage: 6V3  Case: 0402  [CAPACITOR_0402]  (hidden comment: Capacitor - 100nF [0402] (Ceramic))
C7  value 100nF  Tolerance: %10  Voltage: 6V3  Case: 0402  [CAPACITOR_0402]  (hidden comment: Capacitor - 100nF [0402] (Ceramic))
R12  value 10K  Tolerance: %1  Case: 0402  Power: 1/16W  [RESISTOR_0402]  (hidden comment: 10K - 0402 - %1 - 1/16W)
R13  value 10K  Tolerance: %1  Case: 0402  Power: 1/16W  [RESISTOR_0402]  (hidden comment: 10K - 0402 - %1 - 1/16W)
U5  Manufacturer Name: NXP  Case: LGA8  [MPL3115A2]  (hidden comment: MPL3115A2R1)

### Ports
I2C_CH3 (bidir, harness I2C_CH3)

### Harnesses
I2C_CH3: I2C_CH3_SCL, I2C_CH3_SDA

### Nets
GND: C6.1 C7.1 U5.3(GND)
VCC: C6.2 R12.2 R13.2 U5.1(VCC) U5.4(VDDIO)
I2C_CH3_SCL: R12.1 U5.8(SCL) ; port I2C_CH3.I2C_CH3_SCL
I2C_CH3_SDA: R13.1 U5.7(SDA) ; port I2C_CH3.I2C_CH3_SDA
MPL3115A2_CAP: C7.2 U5.2(CAP)

Not connected (* = marked no-connect by the designer): U5 5(INT2)* 6(INT1)*

### Notes on the sheet
- Decoupling Capacitor. As close as possible to MPL3115A2 pin-1.
- © 2021 All rights reserved.
  This document may not, in whole or in part, be copied, photocopied, reproduced, translated or converted to any electronic or machine readable from without prior written permission of Mehmet Günce Akkoyun.
  Engineer contact : akkoyun@me.com
- Property of
- Engineer :
- Date :
- Size :
- A4
- Time :
- Project :
- Page :
- /
- Customer :
- Product ID :
- Module ID :
- Version :
- File :
- Revision :

### Library data of the parts
C6 C7 = Capacitor - 100nF [0402-6V3]: as C1 on sheet I2C Multiplexer; ComponentLink1Description: Mouser; ComponentLink1URL: https://www.mouser.com.tr/ProductDetail/AVX/04026D104KAT4A?qs=sGAEpiMZZMs0AnBnWHyRQPg4iYkCw7IMED%2F4kpqgf7w%3D; ComponentLink2Description: DataSheet; ComponentLink2URL: https://www.mouser.com.tr/datasheet/2/40/cx5r-776519.pdf
R12 R13 = Resistor - 10K [0402]: as R5 on sheet I2C Multiplexer; ComponentLink1Description: DataSheet; ComponentLink1URL: https://www.mouser.com.tr/datasheet/2/427/dcrcwe3-1762152.pdf; ComponentLink2Description: Mouser; ComponentLink2URL: https://www.mouser.com.tr/ProductDetail/Vishay-Dale/CRCW040210K0FKED?qs=sGAEpiMZZMu61qfTUdNhG2DpbjADlD3GcalbOv9utCY%3D
U5 = IC - MPL3115A2R1: Board Mount Pressure Sensors; Operating Pressure: 20 kPa to 110 kPa; RoHS: Yes; Product Type: Absolute Pressure Sensors; Manufacturer Part Number: MPL3115A2R1

## Sheet RS485 Network.SchDoc: RS485 Network
size 292 x 193 mm; SheetNumber: 14; SheetTotal: 21
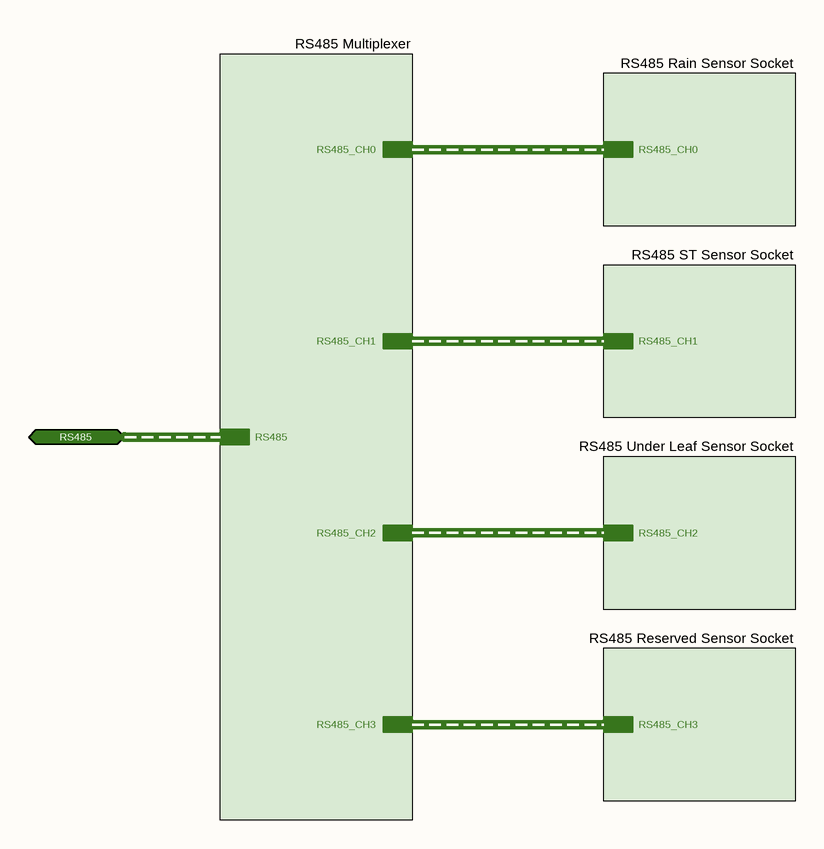
[diagram p11: RS485 Network.SchDoc]

### Sub-sheets
RS485 Multiplexer = RS485 Multiplexer.SchDoc: RS485_CH3 (harness RS485_CH3), RS485_CH0 (harness RS485_CH0), RS485 (harness RS485), RS485_CH2 (harness RS485_CH2), RS485_CH1 (harness RS485_CH1)
RS485 Rain Sensor Socket = RS485 Rain Sensor Socket.SchDoc: RS485_CH0 (harness RS485_CH0)
RS485 Reserved Sensor Socket = RS485 Reserved Sensor Socket.SchDoc: RS485_CH3 (harness RS485_CH3)
RS485 ST Sensor Socket = RS485 Soil Temperature Sensor Socket.SchDoc: RS485_CH1 (harness RS485_CH1)
RS485 Under Leaf Sensor Socket = RS485 Under Leaf Sensor Socket.SchDoc: RS485_CH2 (harness RS485_CH2)

### Ports
RS485 (bidir, harness RS485)

### Buses and harness runs
harness port RS485 = sheet RS485 Multiplexer/RS485
harness sheet RS485 Multiplexer/RS485_CH0 = sheet RS485 Rain Sensor Socket/RS485_CH0
harness sheet RS485 Multiplexer/RS485_CH1 = sheet RS485 ST Sensor Socket/RS485_CH1
harness sheet RS485 Multiplexer/RS485_CH2 = sheet RS485 Under Leaf Sensor Socket/RS485_CH2
harness sheet RS485 Multiplexer/RS485_CH3 = sheet RS485 Reserved Sensor Socket/RS485_CH3

### Notes on the sheet
- © 2021 All rights reserved.
  This document may not, in whole or in part, be copied, photocopied, reproduced, translated or converted to any electronic or machine readable from without prior written permission of Mehmet Günce Akkoyun.
  Engineer contact : akkoyun@me.com
- Property of
- Engineer :
- Date :
- Size :
- A4
- Time :
- Project :
- Page :
- /
- Customer :
- Product ID :
- Module ID :
- Version :
- File :
- Revision :

## Sheet RS485 Multiplexer.SchDoc: RS485 Multiplexer
size 292 x 193 mm; SheetNumber: 15; SheetTotal: 21
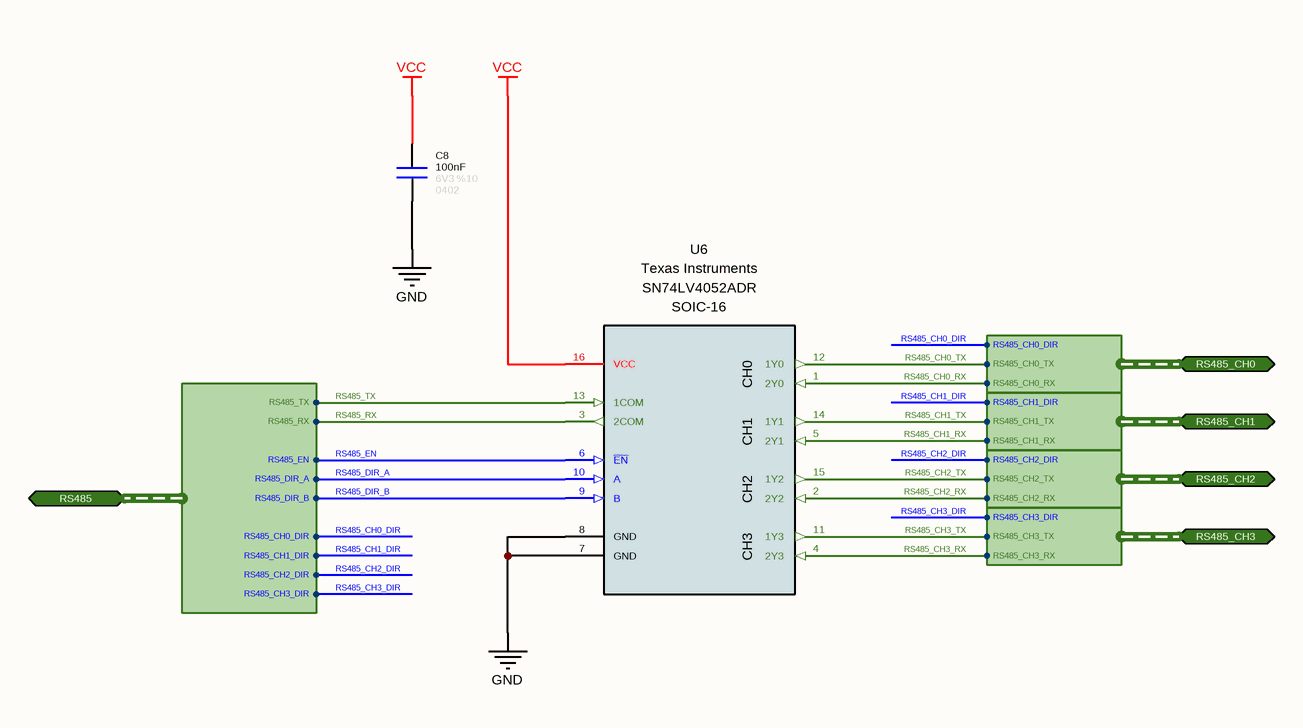
[diagram p12: RS485 Multiplexer.SchDoc]

### Parts
C8  value 100nF  Tolerance: %10  Voltage: 6V3  Case: 0402  [CAPACITOR_0402]  (hidden comment: Capacitor - 100nF [0402] (Ceramic))
U6  Manufacturer Name: Texas Instruments  Case: SOIC-16  [SOIC-16 Narrow]  (hidden comment: SN74LV4052ADR)

### Ports
RS485 (bidir, harness RS485), RS485_CH0 (bidir, harness RS485_CH0), RS485_CH1 (bidir, harness RS485_CH1), RS485_CH2 (bidir, harness RS485_CH2), RS485_CH3 (bidir, harness RS485_CH3)

### Harnesses
RS485_CH0: RS485_CH0_RX, RS485_CH0_TX, RS485_CH0_DIR
RS485_CH1: RS485_CH1_RX, RS485_CH1_TX, RS485_CH1_DIR
RS485_CH2: RS485_CH2_RX, RS485_CH2_TX, RS485_CH2_DIR
RS485_CH3: RS485_CH3_RX, RS485_CH3_TX, RS485_CH3_DIR
RS485: RS485_RX, RS485_TX, RS485_EN, RS485_DIR_A, RS485_DIR_B, RS485_CH0_DIR, RS485_CH1_DIR, RS485_CH2_DIR, RS485_CH3_DIR

### Nets
GND: C8.1 U6.7(GND) U6.8(GND)
VCC: C8.2 U6.16(VCC)
RS485_CH0_DIR: port RS485_CH0.RS485_CH0_DIR, port RS485.RS485_CH0_DIR
RS485_CH0_RX: U6.1(2Y0) ; port RS485_CH0.RS485_CH0_RX
RS485_CH0_TX: U6.12(1Y0) ; port RS485_CH0.RS485_CH0_TX
RS485_CH1_DIR: port RS485_CH1.RS485_CH1_DIR, port RS485.RS485_CH1_DIR
RS485_CH1_RX: U6.5(2Y1) ; port RS485_CH1.RS485_CH1_RX
RS485_CH1_TX: U6.14(1Y1) ; port RS485_CH1.RS485_CH1_TX
RS485_CH2_DIR: port RS485_CH2.RS485_CH2_DIR, port RS485.RS485_CH2_DIR
RS485_CH2_RX: U6.2(2Y2) ; port RS485_CH2.RS485_CH2_RX
RS485_CH2_TX: U6.15(1Y2) ; port RS485_CH2.RS485_CH2_TX
RS485_CH3_DIR: port RS485_CH3.RS485_CH3_DIR, port RS485.RS485_CH3_DIR
RS485_CH3_RX: U6.4(2Y3) ; port RS485_CH3.RS485_CH3_RX
RS485_CH3_TX: U6.11(1Y3) ; port RS485_CH3.RS485_CH3_TX
RS485_DIR_A: U6.10(A) ; port RS485.RS485_DIR_A
RS485_DIR_B: U6.9(B) ; port RS485.RS485_DIR_B
RS485_EN: U6.6(~{EN}) ; port RS485.RS485_EN
RS485_RX: U6.3(2COM) ; port RS485.RS485_RX
RS485_TX: U6.13(1COM) ; port RS485.RS485_TX

### Notes on the sheet
- © 2021 All rights reserved.
  This document may not, in whole or in part, be copied, photocopied, reproduced, translated or converted to any electronic or machine readable from without prior written permission of Mehmet Günce Akkoyun.
  Engineer contact : akkoyun@me.com
- Property of
- Engineer :
- Date :
- Size :
- A4
- Time :
- Project :
- Page :
- /
- Customer :
- Product ID :
- Module ID :
- Version :
- File :
- Revision :
- (in symbol IC - SN74LV4052ADR) CH0; CH1; CH2; CH3

### Library data of the parts
C8 = Capacitor - 100nF [0402-6V3]: as C1 on sheet I2C Multiplexer; ComponentLink1Description: Mouser; ComponentLink1URL: https://www.mouser.com.tr/ProductDetail/AVX/04026D104KAT4A?qs=sGAEpiMZZMs0AnBnWHyRQPg4iYkCw7IMED%2F4kpqgf7w%3D; ComponentLink2Description: DataSheet; ComponentLink2URL: https://www.mouser.com.tr/datasheet/2/40/cx5r-776519.pdf
U6 = IC - SN74LV4052ADR: Multiplexer Switch ICs Dual 4-Ch Analog Mltplxr/Demltplxr; Channel: 4; Maximum Operating Temperature: + 85 C; Minimum Operating Temperature: - 40 C; Product Type: Multiplexer Switch ICs; Manufacturer Part Number: SN74LV4052ADR

## Sheet RS485 Rain Sensor Socket.SchDoc: RS485 Rain Sensor Socket
size 292 x 193 mm; SheetNumber: 16; SheetTotal: 21
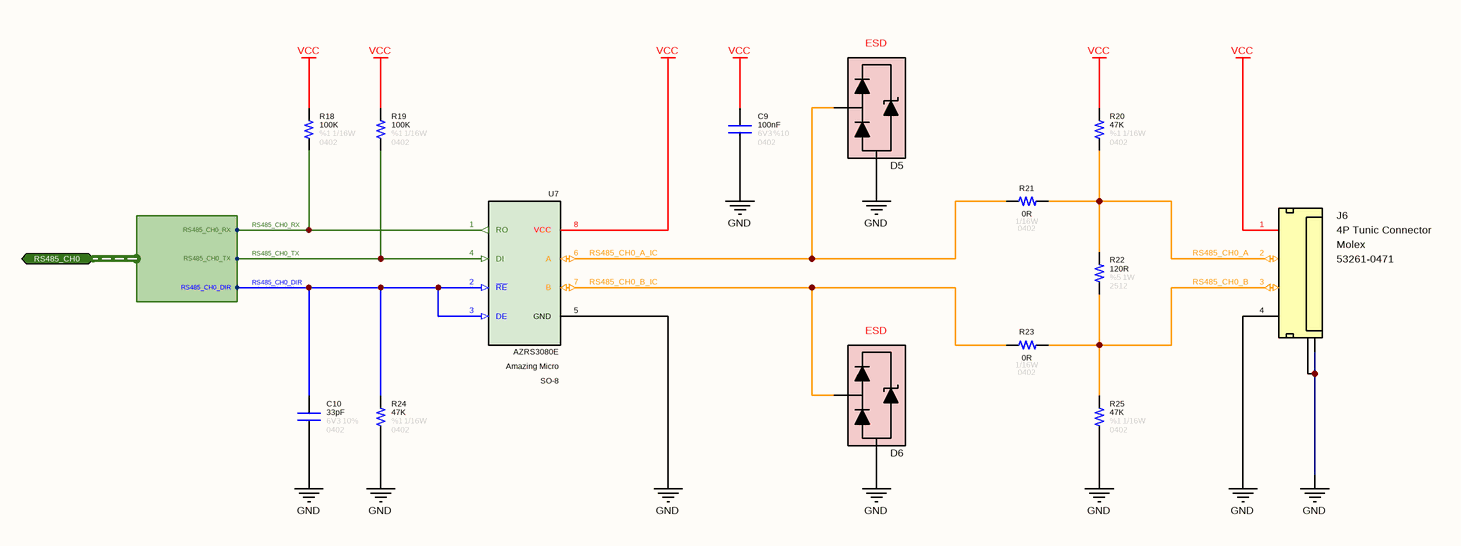
[diagram p13: RS485 Rain Sensor Socket.SchDoc]

### Parts
C9  value 100nF  Tolerance: %10  Voltage: 6V3  Case: 0402  [CAPACITOR_0402]  (hidden comment: Capacitor - 100nF [0402] (Ceramic))
C10  value 33pF  Tolerance: 10%  Case: 0402  Voltage: 6V3  [CAPACITOR_0402]  (hidden comment: Capacitor - 33pF [0402] (Ceramic))
D5  0402ESDA-MLP1  [ESD_0402]  (value not drawn)
D6  0402ESDA-MLP1  [ESD_0402]  (value not drawn)
J6  Manufacturer Name: Molex  Manufacturer Part Number: 53261-0471  [Connector_Tunic 4P]  (hidden comment: 4P SMD Tunic Connector)
R18  value 100K  Tolerance: %1  Case: 0402  Power: 1/16W  [RESISTOR_0402]  (hidden comment: 100K - 0402 - %1 - 1/16W)
R19  value 100K  Tolerance: %1  Case: 0402  Power: 1/16W  [RESISTOR_0402]  (hidden comment: 100K - 0402 - %1 - 1/16W)
R20  value 47K  Tolerance: %1  Case: 0402  Power: 1/16W  [RESISTOR_0402]  (hidden comment: 47K - 0402 - %1 - 1/16W)
R21  value 0R  Case: 0402  Power: 1/16W  [RESISTOR_0402]  (hidden comment: 0R - 0402 - %1 - 1/16W)
R22  value 120R  Tolerance: %5  Case: 2512  Power: 1W  [RESISTOR_2512]  (hidden comment: 120R - 2512 - %5 - 1W)
R23  value 0R  Case: 0402  Power: 1/16W  [RESISTOR_0402]  (hidden comment: 0R - 0402 - %1 - 1/16W)
R24  value 47K  Tolerance: %1  Case: 0402  Power: 1/16W  [RESISTOR_0402]  (hidden comment: 47K - 0402 - %1 - 1/16W)
R25  value 47K  Tolerance: %1  Case: 0402  Power: 1/16W  [RESISTOR_0402]  (hidden comment: 47K - 0402 - %1 - 1/16W)
U7  Case: SO-8  Manufacturer Part Number: AZRS3080E  Manufacturer Name: Amazing Micro  [SOP-8L (AZRS3080E)]  (hidden comment: RS485 Modulator)

### Ports
RS485_CH0 (bidir, harness RS485_CH0)

### Harnesses
RS485_CH0: RS485_CH0_RX, RS485_CH0_TX, RS485_CH0_DIR

### Nets
GND: C9.1 C10.1 D5.2(GND) D6.2(GND) J6.4(Pin-4) J6.5(GND) J6.6(GND) R24.1 R25.1 U7.5(GND)
VCC: C9.2 J6.1(Pin-1) R18.2 R19.2 R20.2 U7.8(VCC)
RS485_CH0_A: J6.2(Pin-2) R20.1 R21.1 R22.2
RS485_CH0_A_IC: D5.1(I/O) R21.2 U7.6(A)
RS485_CH0_B: J6.3(Pin-3) R22.1 R23.1 R25.2
RS485_CH0_B_IC: D6.1(I/O) R23.2 U7.7(B)
RS485_CH0_DIR: C10.2 R24.2 U7.2(~{RE}) U7.3(DE) ; port RS485_CH0.RS485_CH0_DIR
RS485_CH0_RX: R18.1 U7.1(RO) ; port RS485_CH0.RS485_CH0_RX
RS485_CH0_TX: R19.1 U7.4(DI) ; port RS485_CH0.RS485_CH0_TX

### Notes on the sheet
- © 2021 All rights reserved.
  This document may not, in whole or in part, be copied, photocopied, reproduced, translated or converted to any electronic or machine readable from without prior written permission of Mehmet Günce Akkoyun.
  Engineer contact : akkoyun@me.com
- Property of
- Engineer :
- Date :
- Size :
- A4
- Time :
- Project :
- Page :
- /
- Customer :
- Product ID :
- Module ID :
- Version :
- File :
- Revision :
- (in symbol Connector - Mini Tunic 4P (1.25)) 4P Tunic Connector
- (in symbol Diode - TPD1E05U06DPYR) ESD

### Library data of the parts
C9 = Capacitor - 100nF [0402-6V3]: as C1 on sheet I2C Multiplexer; ComponentLink1Description: Mouser; ComponentLink1URL: https://www.mouser.com.tr/ProductDetail/AVX/04026D104KAT4A?qs=sGAEpiMZZMs0AnBnWHyRQPg4iYkCw7IMED%2F4kpqgf7w%3D; ComponentLink2Description: DataSheet; ComponentLink2URL: https://www.mouser.com.tr/datasheet/2/40/cx5r-776519.pdf
C10 = Capacitor - 33pF [0402-6V3]: Manufacturer Name: Kemet; Manufacturer Part Number: C0402C330J9RACAUTO; ComponentLink1Description: DataSheet; ComponentLink1URL: https://api.kemet.com/component-edge/download/datasheet/C0402C330J9RACAUTO.pdf; ComponentLink2Description: Mouser; ComponentLink2URL: https://www.mouser.com/Search/Refine.aspx?Keyword=80-C0402C330J9RAUTO
D5 D6 = Diode - TPD1E05U06DPYR: as D1 on sheet I2C TH Sensor Socket; Manufacturer Part Number: 0402ESDA-MLP1; Case: 0402
J6 = Connector - Mini Tunic 4P (1.25): as J4 on sheet I2C TH Sensor Socket; ROHS: Yes; ComponentLink1Description: DataSheet; ComponentLink1URL: https://www.mouser.com.tr/datasheet/2/276/0532610471_PCB_HEADERS-170942.pdf; ComponentLink2Description: Mouser; ComponentLink2URL: https://www.mouser.com.tr/ProductDetail/Molex/53261-0471?qs=%2Fha2pyFaduhLhIsk8tywtK7BwWtguBSP4XxyDBTOTfs%3D; Case: SMD
R18 R19 = Resistor - 100K [0402]: Thick Film Resistors - SMD 1/16 W 100 KOhm 1%; Manufacturer Name: Vishay; Manufacturer Part Number: CRCW0402100KFKED; ComponentLink1Description: DataSheet; ComponentLink1URL: https://www.mouser.com.tr/datasheet/2/427/dcrcwe3-1762152.pdf; ComponentLink2Description: Mouser; ComponentLink2URL: https://www.mouser.com.tr/ProductDetail/Vishay-Dale/CRCW040210K0FKED?qs=sGAEpiMZZMu61qfTUdNhG2DpbjADlD3GcalbOv9utCY%3D
R20 R24 R25 = Resistor - 47K [0402]: as R1 on sheet B001 PCIe Socket; ComponentLink1Description: DataSheet; ComponentLink1URL: https://www.mouser.com.tr/datasheet/2/427/dcrcwe3-1762152.pdf; ComponentLink2Description: Mouser; ComponentLink2URL: https://www.mouser.com.tr/ProductDetail/Vishay-Dale/CRCW040247K0FKED?qs=sGAEpiMZZMu61qfTUdNhG2DpbjADlD3GL%252B3h1elTxqU%3D
R21 R23 = Resistor - 0R [0402]: Thick Film Resistors - SMD 1/16 W 0 Ohm; Manufacturer Name: Vishay; Manufacturer Part Number: CRCW04020000Z0ED; ComponentLink1Description: DataSheet; ComponentLink1URL: https://www.mouser.com.tr/datasheet/2/427/dcrcwe3-1762152.pdf; ComponentLink2Description: Mouser; ComponentLink2URL: https://www.mouser.com.tr/ProductDetail/Vishay-Dale/CRCW04020000Z0ED?qs=sGAEpiMZZMu61qfTUdNhG2DpbjADlD3GG34cJb50zyg%3D
R22 = Resistor - 120R [2512]: Thick Film Resistors - SMD 1 W 120 Ohm 5%; Manufacturer Name: YAGEO; Manufacturer Part Number: RC2512JK-07120RL; ComponentLink1Description: DataSheet; ComponentLink1URL: https://www.mouser.com.tr/datasheet/2/447/PYu_RC_Group_51_RoHS_L_11-1984063.pdf
U7 = IC - AZRS3080E: Half-duplex RS485 transceiver.; RoHS: Yes; ComponentLink1Description: DataSheet; ComponentLink1URL: https://www.amazingic.com/common/frontend/download?path=/uploads/images/products/PDF/AZRS/AZRS3080E.pdf

## Sheet RS485 Soil Temperature Sensor Socket.SchDoc: RS485 Soil Temperature Socket
size 292 x 193 mm; SheetNumber: 17; SheetTotal: 21
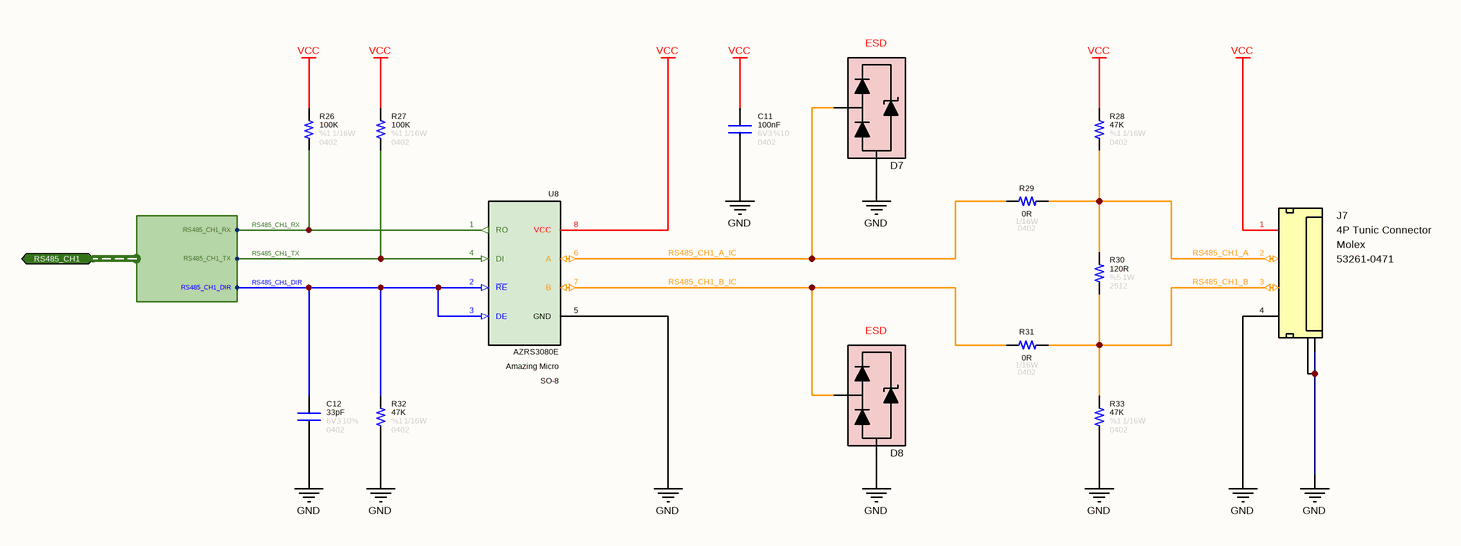
[diagram p14: RS485 Soil Temperature Sensor Socket.SchDoc]

### Parts
C11  value 100nF  Tolerance: %10  Voltage: 6V3  Case: 0402  [CAPACITOR_0402]  (hidden comment: Capacitor - 100nF [0402] (Ceramic))
C12  value 33pF  Tolerance: 10%  Case: 0402  Voltage: 6V3  [CAPACITOR_0402]  (hidden comment: Capacitor - 33pF [0402] (Ceramic))
D7  0402ESDA-MLP1  [ESD_0402]  (value not drawn)
D8  0402ESDA-MLP1  [ESD_0402]  (value not drawn)
J7  Manufacturer Name: Molex  Manufacturer Part Number: 53261-0471  [Connector_Tunic 4P]  (hidden comment: 4P SMD Tunic Connector)
R26  value 100K  Tolerance: %1  Case: 0402  Power: 1/16W  [RESISTOR_0402]  (hidden comment: 100K - 0402 - %1 - 1/16W)
R27  value 100K  Tolerance: %1  Case: 0402  Power: 1/16W  [RESISTOR_0402]  (hidden comment: 100K - 0402 - %1 - 1/16W)
R28  value 47K  Tolerance: %1  Case: 0402  Power: 1/16W  [RESISTOR_0402]  (hidden comment: 47K - 0402 - %1 - 1/16W)
R29  value 0R  Case: 0402  Power: 1/16W  [RESISTOR_0402]  (hidden comment: 0R - 0402 - %1 - 1/16W)
R30  value 120R  Tolerance: %5  Case: 2512  Power: 1W  [RESISTOR_2512]  (hidden comment: 120R - 2512 - %5 - 1W)
R31  value 0R  Case: 0402  Power: 1/16W  [RESISTOR_0402]  (hidden comment: 0R - 0402 - %1 - 1/16W)
R32  value 47K  Tolerance: %1  Case: 0402  Power: 1/16W  [RESISTOR_0402]  (hidden comment: 47K - 0402 - %1 - 1/16W)
R33  value 47K  Tolerance: %1  Case: 0402  Power: 1/16W  [RESISTOR_0402]  (hidden comment: 47K - 0402 - %1 - 1/16W)
U8  Case: SO-8  Manufacturer Part Number: AZRS3080E  Manufacturer Name: Amazing Micro  [SOP-8L (AZRS3080E)]  (hidden comment: RS485 Modulator)

### Ports
RS485_CH1 (bidir, harness RS485_CH1)

### Harnesses
RS485_CH1: RS485_CH1_RX, RS485_CH1_TX, RS485_CH1_DIR

### Nets
GND: C11.1 C12.1 D7.2(GND) D8.2(GND) J7.4(Pin-4) J7.5(GND) J7.6(GND) R32.1 R33.1 U8.5(GND)
VCC: C11.2 J7.1(Pin-1) R26.2 R27.2 R28.2 U8.8(VCC)
RS485_CH1_A: J7.2(Pin-2) R28.1 R29.1 R30.2
RS485_CH1_A_IC: D7.1(I/O) R29.2 U8.6(A)
RS485_CH1_B: J7.3(Pin-3) R30.1 R31.1 R33.2
RS485_CH1_B_IC: D8.1(I/O) R31.2 U8.7(B)
RS485_CH1_DIR: C12.2 R32.2 U8.2(~{RE}) U8.3(DE) ; port RS485_CH1.RS485_CH1_DIR
RS485_CH1_RX: R26.1 U8.1(RO) ; port RS485_CH1.RS485_CH1_RX
RS485_CH1_TX: R27.1 U8.4(DI) ; port RS485_CH1.RS485_CH1_TX

### Notes on the sheet
- © 2021 All rights reserved.
  This document may not, in whole or in part, be copied, photocopied, reproduced, translated or converted to any electronic or machine readable from without prior written permission of Mehmet Günce Akkoyun.
  Engineer contact : akkoyun@me.com
- Property of
- Engineer :
- Date :
- Size :
- A4
- Time :
- Project :
- Page :
- /
- Customer :
- Product ID :
- Module ID :
- Version :
- File :
- Revision :
- (in symbol Connector - Mini Tunic 4P (1.25)) 4P Tunic Connector
- (in symbol Diode - TPD1E05U06DPYR) ESD

### Library data of the parts
C11 = Capacitor - 100nF [0402-6V3]: as C1 on sheet I2C Multiplexer; ComponentLink1Description: Mouser; ComponentLink1URL: https://www.mouser.com.tr/ProductDetail/AVX/04026D104KAT4A?qs=sGAEpiMZZMs0AnBnWHyRQPg4iYkCw7IMED%2F4kpqgf7w%3D; ComponentLink2Description: DataSheet; ComponentLink2URL: https://www.mouser.com.tr/datasheet/2/40/cx5r-776519.pdf
C12 = Capacitor - 33pF [0402-6V3]: as C10 on sheet RS485 Rain Sensor Socket; ComponentLink1Description: DataSheet; ComponentLink1URL: https://api.kemet.com/component-edge/download/datasheet/C0402C330J9RACAUTO.pdf; ComponentLink2Description: Mouser; ComponentLink2URL: https://www.mouser.com/Search/Refine.aspx?Keyword=80-C0402C330J9RAUTO
D7 D8 = Diode - TPD1E05U06DPYR: as D1 on sheet I2C TH Sensor Socket; Manufacturer Part Number: 0402ESDA-MLP1; Case: 0402
J7 = Connector - Mini Tunic 4P (1.25): as J4 on sheet I2C TH Sensor Socket; ROHS: Yes; ComponentLink1Description: DataSheet; ComponentLink1URL: https://www.mouser.com.tr/datasheet/2/276/0532610471_PCB_HEADERS-170942.pdf; ComponentLink2Description: Mouser; ComponentLink2URL: https://www.mouser.com.tr/ProductDetail/Molex/53261-0471?qs=%2Fha2pyFaduhLhIsk8tywtK7BwWtguBSP4XxyDBTOTfs%3D; Case: SMD
R26 R27 = Resistor - 100K [0402]: as R18 on sheet RS485 Rain Sensor Socket; ComponentLink1Description: DataSheet; ComponentLink1URL: https://www.mouser.com.tr/datasheet/2/427/dcrcwe3-1762152.pdf; ComponentLink2Description: Mouser; ComponentLink2URL: https://www.mouser.com.tr/ProductDetail/Vishay-Dale/CRCW040210K0FKED?qs=sGAEpiMZZMu61qfTUdNhG2DpbjADlD3GcalbOv9utCY%3D
R28 R32 R33 = Resistor - 47K [0402]: as R1 on sheet B001 PCIe Socket; ComponentLink1Description: DataSheet; ComponentLink1URL: https://www.mouser.com.tr/datasheet/2/427/dcrcwe3-1762152.pdf; ComponentLink2Description: Mouser; ComponentLink2URL: https://www.mouser.com.tr/ProductDetail/Vishay-Dale/CRCW040247K0FKED?qs=sGAEpiMZZMu61qfTUdNhG2DpbjADlD3GL%252B3h1elTxqU%3D
R29 R31 = Resistor - 0R [0402]: as R21 on sheet RS485 Rain Sensor Socket; ComponentLink1Description: DataSheet; ComponentLink1URL: https://www.mouser.com.tr/datasheet/2/427/dcrcwe3-1762152.pdf; ComponentLink2Description: Mouser; ComponentLink2URL: https://www.mouser.com.tr/ProductDetail/Vishay-Dale/CRCW04020000Z0ED?qs=sGAEpiMZZMu61qfTUdNhG2DpbjADlD3GG34cJb50zyg%3D
R30 = Resistor - 120R [2512]: as R22 on sheet RS485 Rain Sensor Socket; ComponentLink1Description: DataSheet; ComponentLink1URL: https://www.mouser.com.tr/datasheet/2/447/PYu_RC_Group_51_RoHS_L_11-1984063.pdf
U8 = IC - AZRS3080E: Half-duplex RS485 transceiver.; RoHS: Yes; ComponentLink1Description: DataSheet; ComponentLink1URL: https://www.amazingic.com/common/frontend/download?path=/uploads/images/products/PDF/AZRS/AZRS3080E.pdf